# EAGLE design Nixie Clock v1.0 (EAGLE 9.6.2)

## Sheet 1 of 5: Microcontroller
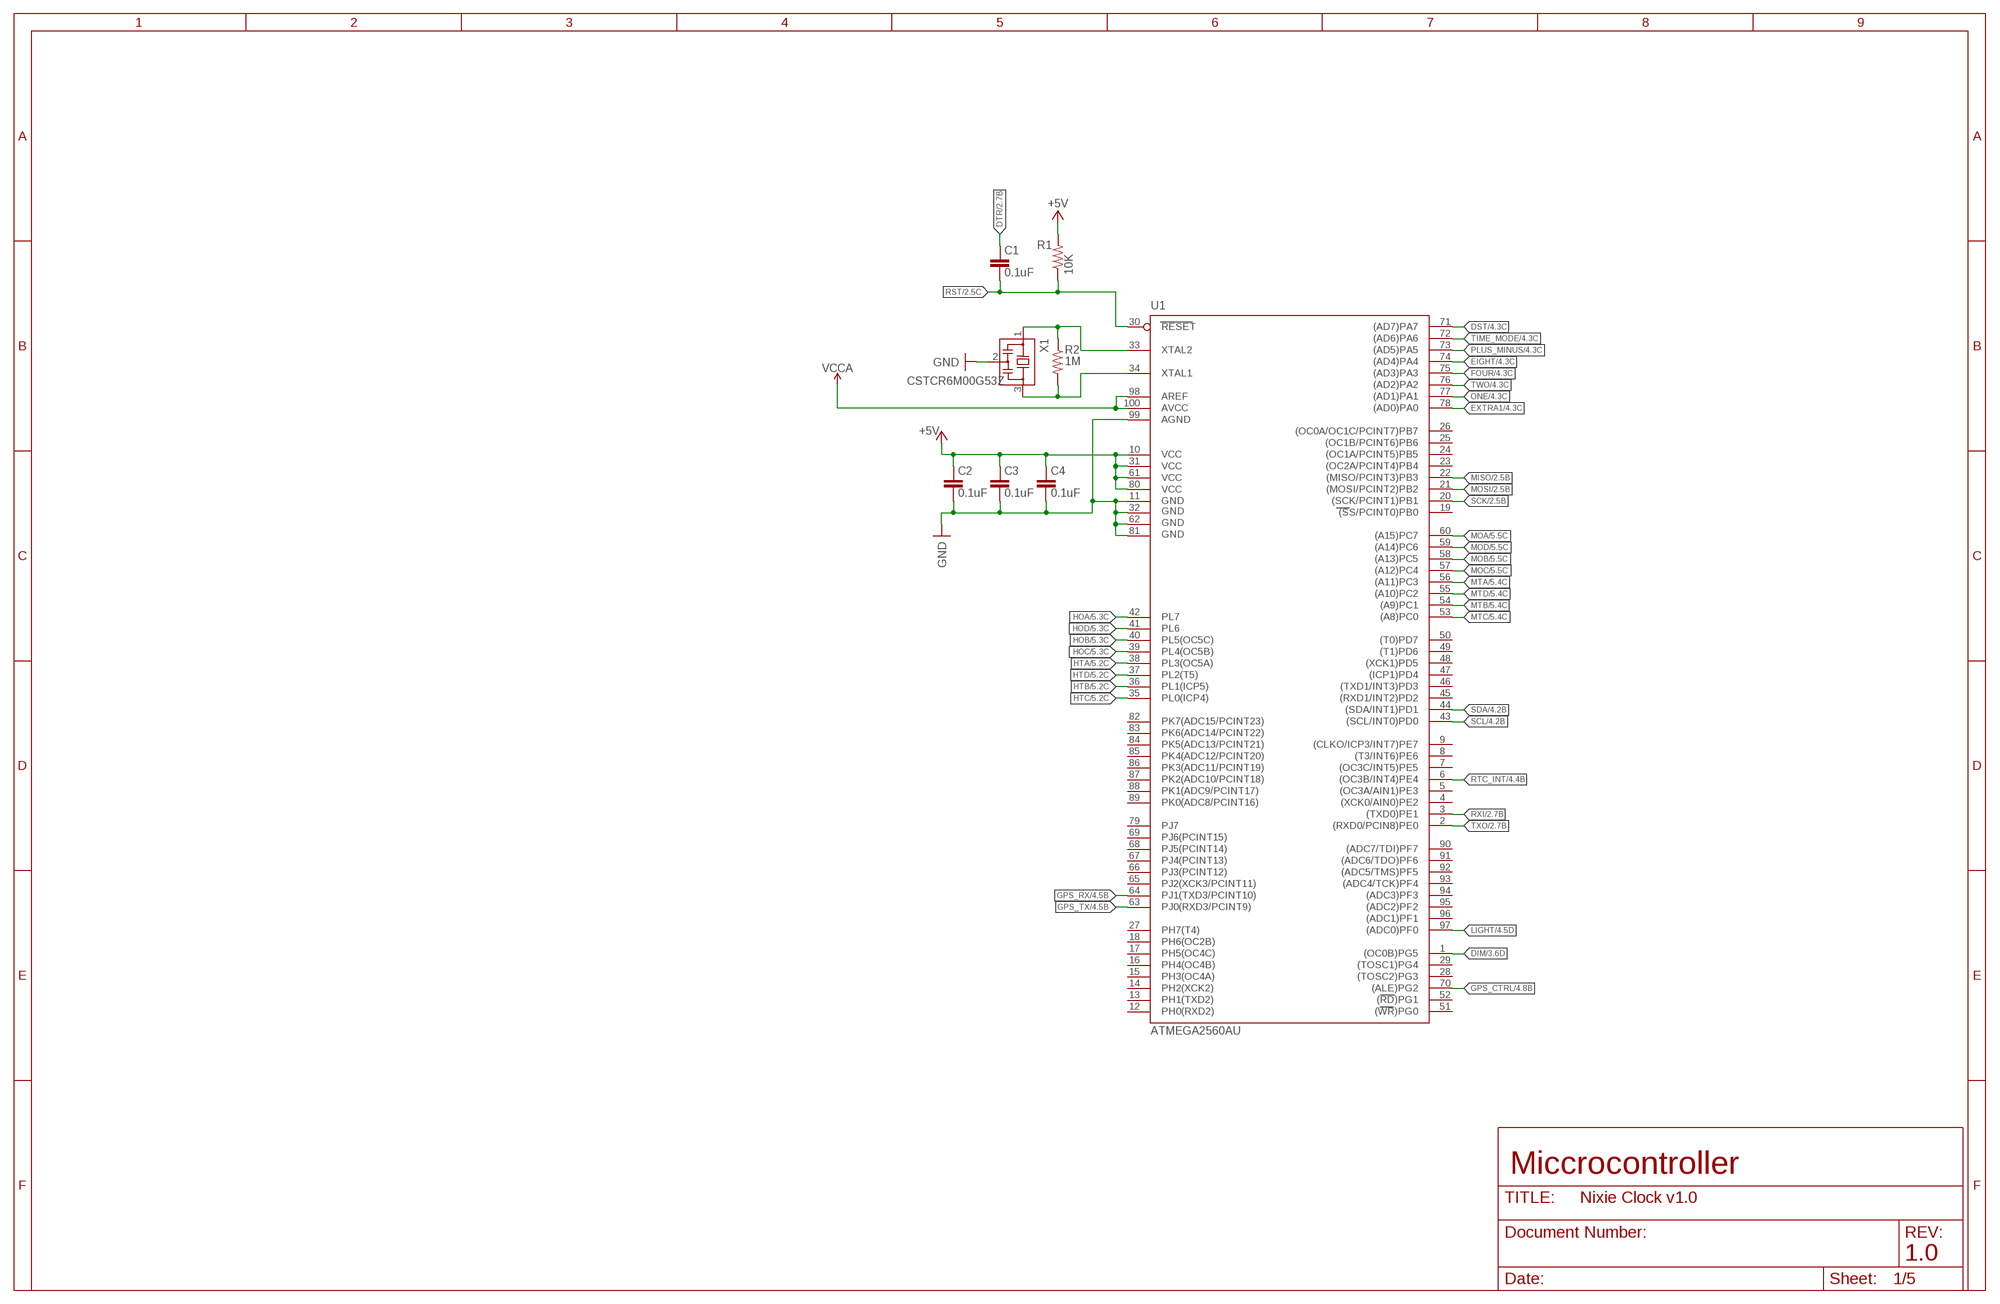
[diagram p0: schematic, sheet 1]

### Parts
C1  0.1uF  C-EUC0603  [C0603]
C2  0.1uF  C-EUC0603  [C0603]
C3  0.1uF  C-EUC0603  [C0603]
C4  0.1uF  C-EUC0603  [C0603]
R1  10K  R-US_R0603  [R0603]
R2  1M  R-US_R0603  [R0603]
U1  ATMEGA2560AU  [TQFP100]
X1  CSTCR6M00G53Z  [CSTCR6M]

### Nets
+5V: C2.1 C3.1 C4.1 R1.2 U1.10(VCC) U1.31(VCC1) U1.61(VCC2) U1.80(VCC3) ; also sheet 2,3,4,5
DIM: U1.1((OC0B)PG5) ; also sheet 3
DST: U1.71((AD7)PA7) ; also sheet 4
DTR: C1.1 ; also sheet 2
EIGHT: U1.74((AD4)PA4) ; also sheet 4
EXTRA1: U1.78((AD0)PA0) ; also sheet 4
FOUR: U1.75((AD3)PA3) ; also sheet 4
GND: C2.2 C3.2 C4.2 U1.11(GND) U1.32(GND1) U1.62(GND2) U1.81(GND3) U1.99(AGND) X1.2 ; also sheet 2,3,4,5
GPS_CTRL: U1.70((ALE)PG2) ; also sheet 4
GPS_RX: U1.64(PJ1(TXD3/PCINT10)) ; also sheet 4
GPS_TX: U1.63(PJ0(RXD3/PCINT9)) ; also sheet 4
HOA: U1.42(PL7) ; also sheet 5
HOB: U1.40(PL5(OC5C)) ; also sheet 5
HOC: U1.39(PL4(OC5B)) ; also sheet 5
HOD: U1.41(PL6) ; also sheet 5
HTA: U1.38(PL3(OC5A)) ; also sheet 5
HTB: U1.36(PL1(ICP5)) ; also sheet 5
HTC: U1.35(PL0(ICP4)) ; also sheet 5
HTD: U1.37(PL2(T5)) ; also sheet 5
LIGHT: U1.97((ADC0)PF0) ; also sheet 4
MISO: U1.22((MISO/PCINT3)PB3) ; also sheet 2
MOA: U1.60((A15)PC7) ; also sheet 5
MOB: U1.58((A13)PC5) ; also sheet 5
MOC: U1.57((A12)PC4) ; also sheet 5
MOD: U1.59((A14)PC6) ; also sheet 5
MOSI: U1.21((MOSI/PCINT2)PB2) ; also sheet 2
MTA: U1.56((A11)PC3) ; also sheet 5
MTB: U1.54((A9)PC1) ; also sheet 5
MTC: U1.53((A8)PC0) ; also sheet 5
MTD: U1.55((A10)PC2) ; also sheet 5
N$60: R2.2 U1.34(XTAL1) X1.3
N$61: R2.1 U1.33(XTAL2) X1.1
ONE: U1.77((AD1)PA1) ; also sheet 4
PLUS_MINUS: U1.73((AD5)PA5) ; also sheet 4
RST: C1.2 R1.1 U1.30(RESET) ; also sheet 2
RTC_INT: U1.6((OC3B/INT4)PE4) ; also sheet 4
RXI: U1.3((TXD0)PE1) ; also sheet 2
SCK: U1.20((SCK/PCINT1)PB1) ; also sheet 2
SCL: U1.43((SCL/INT0)PD0) ; also sheet 4
SDA: U1.44((SDA/INT1)PD1) ; also sheet 4
TIME_MODE: U1.72((AD6)PA6) ; also sheet 4
TWO: U1.76((AD2)PA2) ; also sheet 4
TXO: U1.2((RXD0/PCIN8)PE0) ; also sheet 2
VCCA: U1.98(AREF) U1.100(AVCC) ; also sheet 3,4
Unconnected: U1.4((XCK0/AIN0)PE2) U1.5((OC3A/AIN1)PE3) U1.7((OC3C/INT5)PE5) U1.8((T3/INT6)PE6) U1.9((CLKO/ICP3/INT7)PE7) U1.12(PH0(RXD2)) U1.13(PH1(TXD2)) U1.14(PH2(XCK2)) U1.15(PH3(OC4A)) U1.16(PH4(OC4B)) U1.17(PH5(OC4C)) U1.18(PH6(OC2B)) U1.19((SS/PCINT0)PB0) U1.23((OC2A/PCINT4)PB4) U1.24((OC1A/PCINT5)PB5) U1.25((OC1B/PCINT6)PB6) U1.26((OC0A/OC1C/PCINT7)PB7) U1.27(PH7(T4)) U1.28((TOSC2)PG3) U1.29((TOSC1)PG4) U1.45((RXD1/INT2)PD2) U1.46((TXD1/INT3)PD3) U1.47((ICP1)PD4) U1.48((XCK1)PD5) U1.49((T1)PD6) U1.50((T0)PD7) U1.51((WR)PG0) U1.52((RD)PG1) U1.65(PJ2(XCK3/PCINT11)) U1.66(PJ3(PCINT12)) U1.67(PJ4(PCINT13)) U1.68(PJ5(PCINT14)) U1.69(PJ6(PCINT15)) U1.79(PJ7) U1.82(PK7(ADC15/PCINT23)) U1.83(PK6(ADC14/PCINT22)) U1.84(PK5(ADC13/PCINT21)) U1.85(PK4(ADC12/PCINT20)) U1.86(PK3(ADC11/PCINT19)) U1.87(PK2(ADC10/PCINT18)) U1.88(PK1(ADC9/PCINT17)) U1.89(PK0(ADC8/PCINT16)) U1.90((ADC7/TDI)PF7) U1.91((ADC6/TDO)PF6) U1.92((ADC5/TMS)PF5) U1.93((ADC4/TCK)PF4) U1.94((ADC3)PF3) U1.95((ADC2)PF2) U1.96((ADC1)PF1)

### Notes on the sheet
- Miccrocontroller
- 1.0

## Sheet 2 of 5: Communication
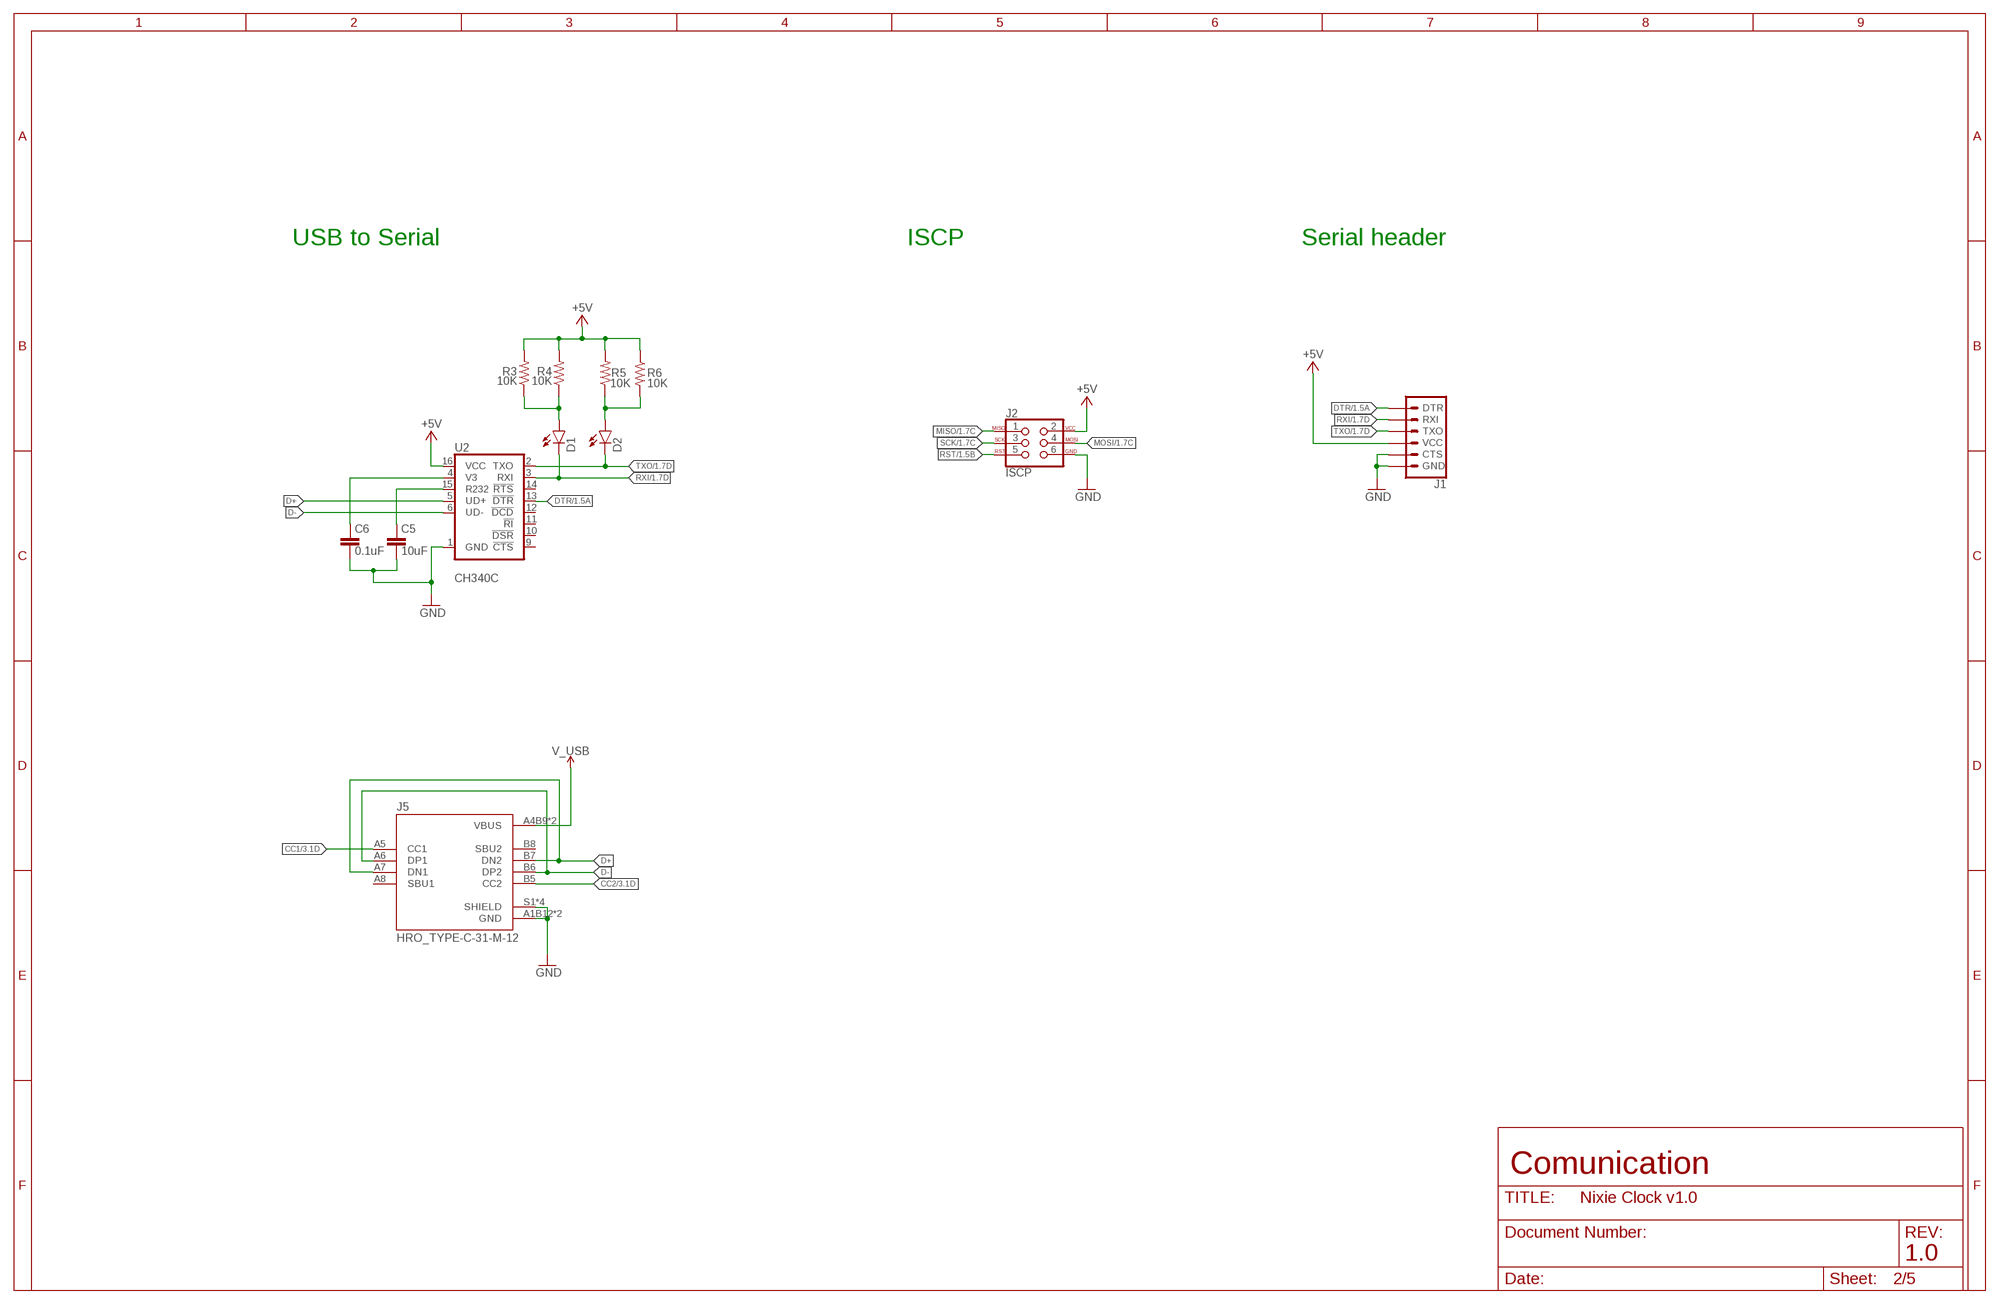
[diagram p1: schematic, sheet 2]

### Parts
C5  10uF  C-EUC0603  [C0603]
C6  0.1uF  C-EUC0603  [C0603]
D1  LEDCHIP-LED0603  [CHIP-LED0603]
D2  LEDCHIP-LED0603  [CHIP-LED0603]
J1  6_PIN_SERIAL_TARGETSILK  [6_PIN_SERIAL_TARGET_SIDE_W_SILK]
J2  ISCP  AVR_SPI_PROG_3X2PTH  [2X3]
J5  HRO_TYPE-C-31-M-12  [HRO_TYPE-C-31-M-12]
R3  10K  R-US_R0603  [R0603]
R4  10K  R-US_R0603  [R0603]
R5  10K  R-US_R0603  [R0603]
R6  10K  R-US_R0603  [R0603]
U2  CH340C  [SO016]

### Nets
+5V: J1.P$4(VCC) J2.2 R3.2 R4.2 R5.2 R6.1 U2.16(VCC) ; also sheet 1,3,4,5
CC1: J5.A5(CC1) ; also sheet 3
CC2: J5.B5(CC2) ; also sheet 3
D+: J5.A7(DN1) J5.B7(DN2) U2.5(UD+)
D-: J5.A6(DP1) J5.B6(DP2) U2.6(UD-)
DTR: J1.P$1(DTR) U2.13(!DTR) ; also sheet 1
GND: C5.2 C6.2 J1.P$5(CTS) J1.P$6(GND) J2.6 J5.A1B12(GND) J5.B1A12(GND) J5.S1(SHIELD) J5.S2(SHIELD) J5.S3(SHIELD) J5.S4(SHIELD) U2.1(GND) ; also sheet 1,3,4,5
MISO: J2.1 ; also sheet 1
MOSI: J2.4 ; also sheet 1
N$1: C5.1 U2.15(R232)
N$2: C6.1 U2.4(V3)
N$49: D1.A R3.1 R4.1
N$50: D2.A R5.1 R6.2
RST: J2.5 ; also sheet 1
RXI: D1.C J1.P$3(RXI) U2.3(RXI) ; also sheet 1
SCK: J2.3 ; also sheet 1
TXO: D2.C J1.P$2(TXO) U2.2(TXO) ; also sheet 1
V_USB: J5.A4B9(VBUS) J5.B4A9(VBUS) ; also sheet 3
Unconnected: J5.A8(SBU1) J5.B8(SBU2) U2.9(!CTS) U2.10(!DSR) U2.11(!RI) U2.12(!DCD) U2.14(!RTS)

### Notes on the sheet
- USB to Serial | ISCP | Serial header
- Comunication
- 1.0

## Sheet 3 of 5: Power
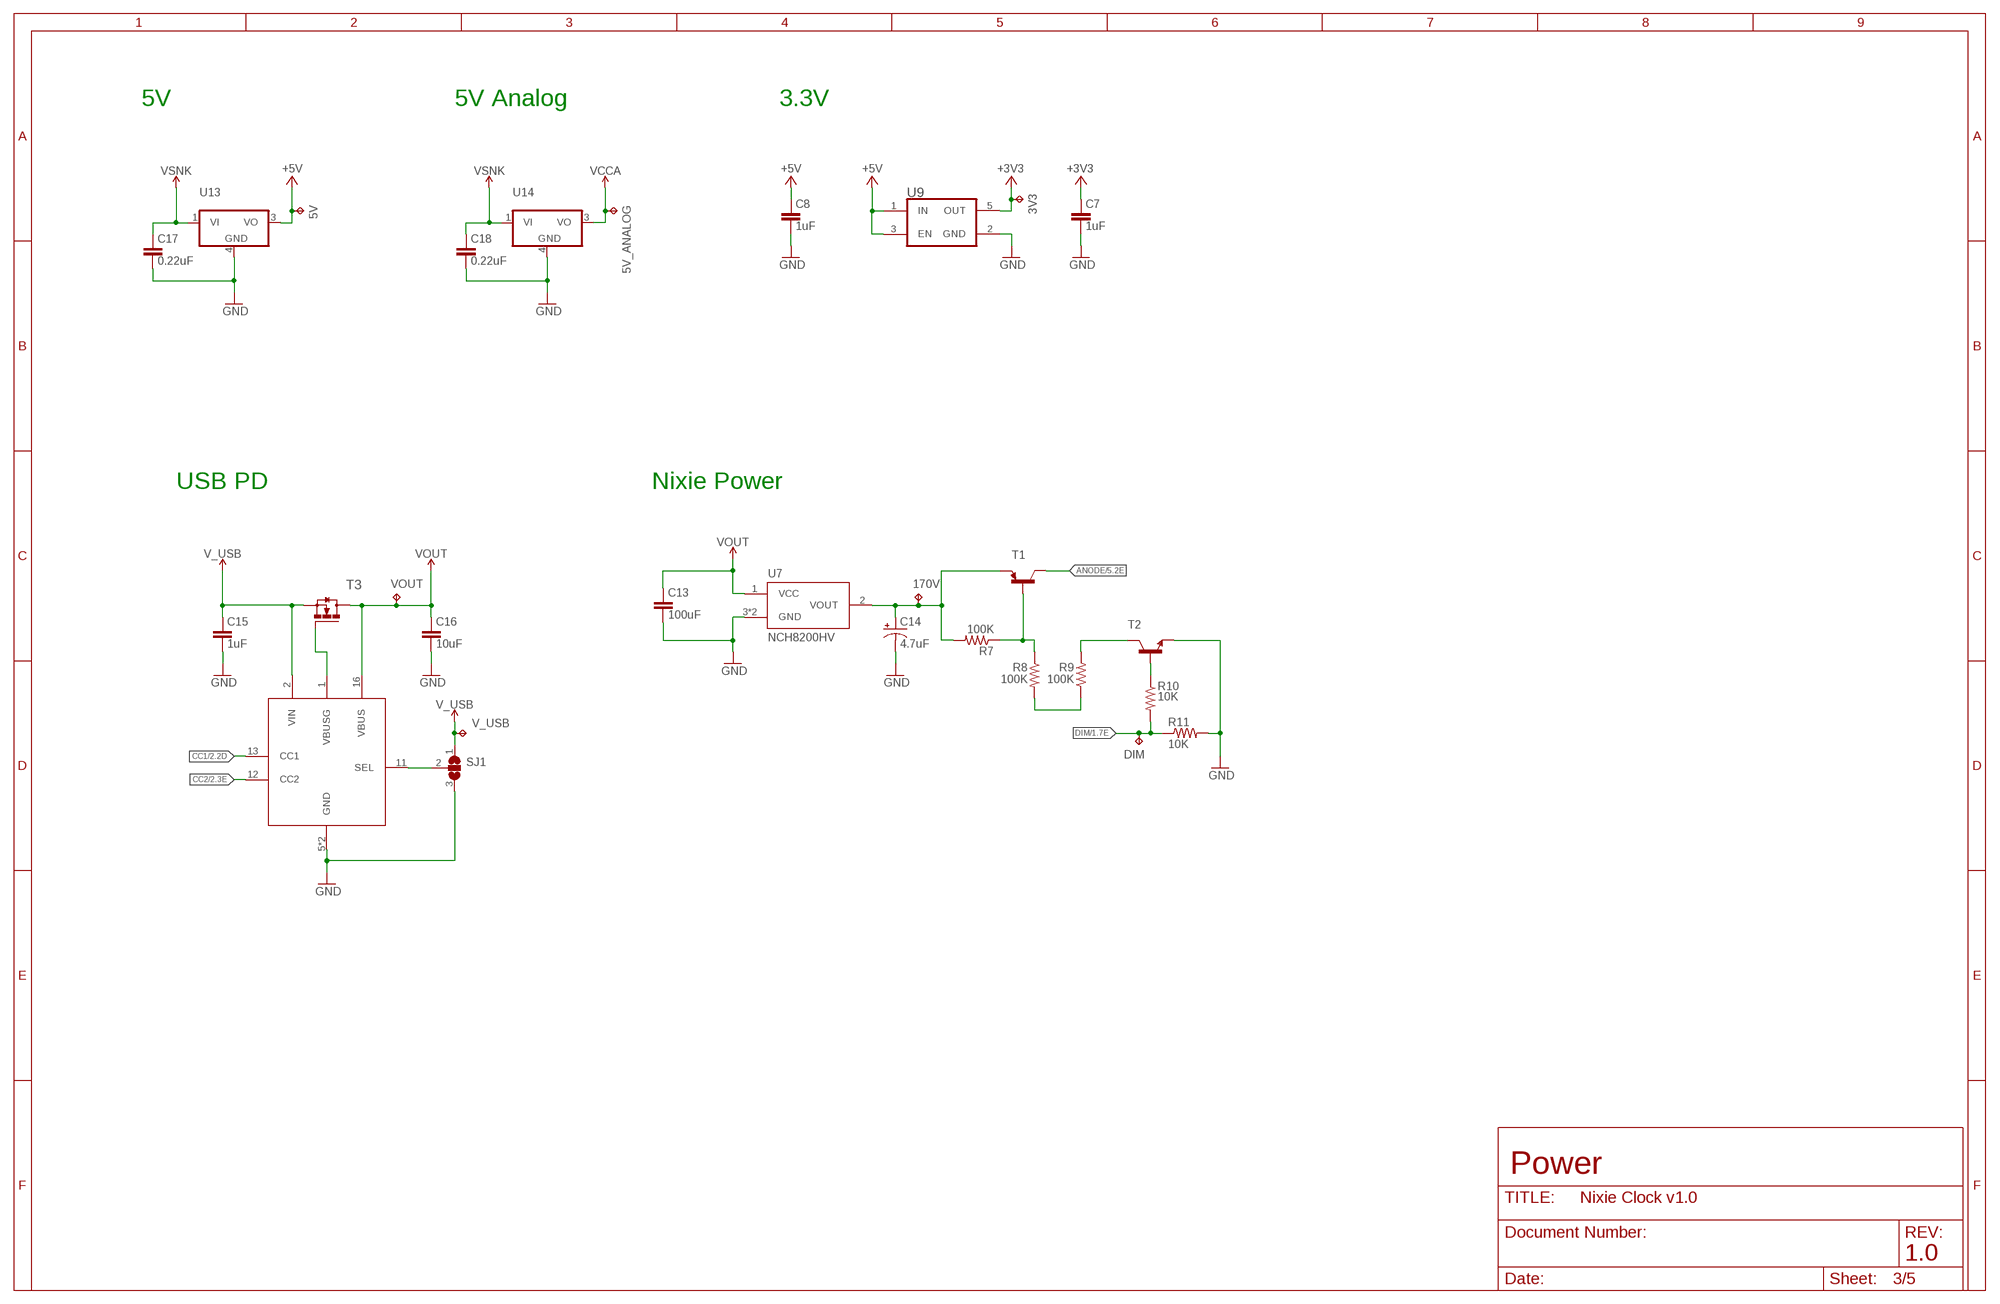
[diagram p2: schematic, sheet 3]

### Parts
3V3  TPPAD1-13  [P1-13]
5V  TPPAD1-13  [P1-13]
5V_ANALOG  TPPAD1-13  [P1-13]
170V  TPPAD1-13  [P1-13]
C7  1uF  C-EUC0603  [C0603]
C8  1uF  C-EUC0603  [C0603]
C13  100uF  C-EUC0603  [C0603]
C14  4.7uF  CPOL-USE3.5-8  [E3,5-8]
C15  1uF  C-EUC0603  [C0603]
C16  10uF  C-EUC0603  [C0603]
C17  0.22uF  C-EUC0603  [C0603]
C18  0.22uF  C-EUC0603  [C0603]
DIM  TPPAD1-13  [P1-13]
R7  100K  R-US_R0603  [R0603]
R8  100K  R-US_R0603  [R0603]
R9  100K  R-US_R0603  [R0603]
R10  10K  R-US_R0603  [R0603]
R11  10K  R-US_R0603  [R0603]
SJ1  SJ2W  [SJ_2]
T1  PZTA92  [SOT223]
T2  PZTA42  [SOT223]
T3  CSD18543Q3A  [VSONP-8]
U7  NCH8200HV  [NCH8200HV]
U9  MIC5504-3.3YM5TR  [SOT95P280X130-5N]
U12  IP2721  [TSSOP16EXP]
U13  LM340MP-05  [SOT223]
U14  LM340MP-05  [SOT223]
V_USB  TPPAD1-13  [P1-13]
VOUT  TPPAD1-13  [P1-13]

### Nets
+3V3: 3V3.TP C7.1 U9.5(OUT) ; also sheet 4
+5V: 5V.TP C8.1 U9.1(IN) U9.3(EN) U13.3(VO) ; also sheet 1,2,4,5
ANODE: T1.2(C) T1.4(C) ; also sheet 5
CC1: U12.13(CC1) ; also sheet 2
CC2: U12.12(CC2) ; also sheet 2
DIM: DIM.TP R10.2 R11.1 ; also sheet 1
GND: C7.2 C8.2 C13.2 C14.- C15.2 C16.2 C17.2 C18.2 R11.2 SJ1.3 T2.3(E) U7.3(GND) U7.4(GND) U9.2(GND) U12.5(GND) U12.EXP(GND) U13.4(GND) U14.4(GND) ; also sheet 1,2,4,5
N$3: T3.4(G) U12.1(VBUSG)
N$4: SJ1.2 U12.11(SEL)
N$6: R10.1 T2.1(B)
N$51: 170V.TP C14.+ R7.2 T1.3(E) U7.2(VOUT)
N$53: R7.1 R8.1 T1.1(B)
N$63: R9.2 T2.2(C) T2.4(C)
N$64: R8.2 R9.1
V_USB: C15.1 SJ1.1 T3.1(S) T3.2(S) T3.3(S) U12.2(VIN) V_USB.TP ; also sheet 2
VCCA: 5V_ANALOG.TP U14.3(VO) ; also sheet 1,4
VOUT: C13.1 C16.1 C17.1 C18.1 T3.5(D) T3.6(D) T3.7(D) T3.8(D) T3.9(D) T3.10(D) T3.11(D) T3.12(D) U7.1(VCC) U12.16(VBUS) U13.1(VI) U14.1(VI) VOUT.TP ; supply symbol labelled VSNK

### Notes on the sheet
- 5V | 5V Analog | 3.3V
- USB PD | Nixie Power
- Power
- 1.0

## Sheet 4 of 5: RTC and GPS
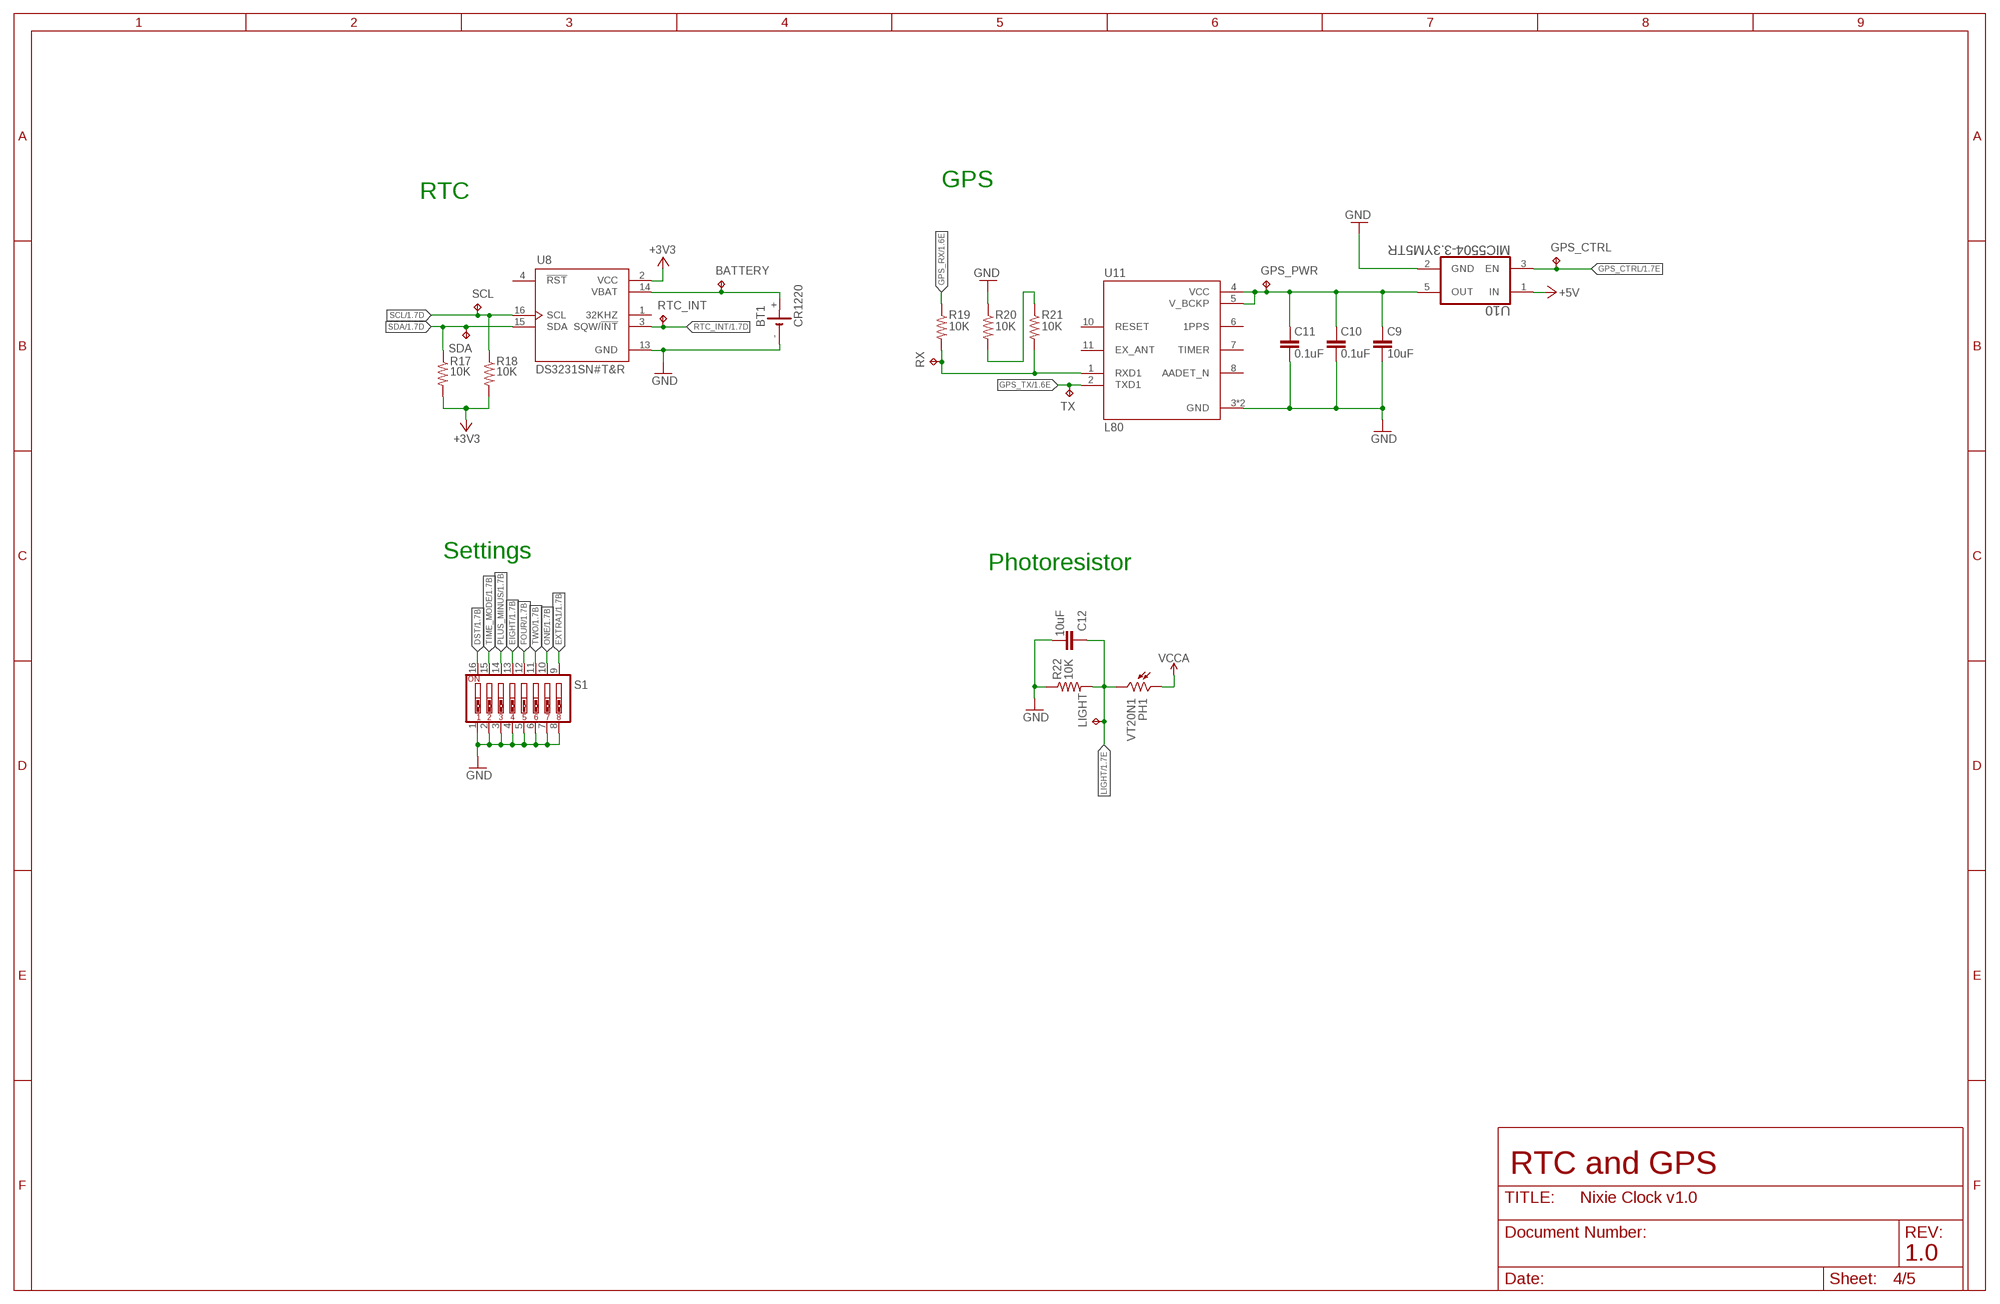
[diagram p3: schematic, sheet 4]

### Parts
BATTERY  TPPAD1-13  [P1-13]
BT1  CR1220  CH291-1220LF  [CH291-1220LF]
C9  10uF  C-EUC0603  [C0603]
C10  0.1uF  C-EUC0603  [C0603]
C11  0.1uF  C-EUC0603  [C0603]
C12  10uF  C-EUC0603  [C0603]
GPS_CTRL  TPPAD1-13  [P1-13]
GPS_PWR  TPPAD1-13  [P1-13]
LIGHT  TPPAD1-13  [P1-13]
PH1  VT20N1  [TO46-VT200]
R17  10K  R-US_R0603  [R0603]
R18  10K  R-US_R0603  [R0603]
R19  10K  R-US_R0603  [R0603]
R20  10K  R-US_R0603  [R0603]
R21  10K  R-US_R0603  [R0603]
R22  10K  R-US_R0603  [R0603]
RTC_INT  TPPAD1-13  [P1-13]
RX  TPPAD1-13  [P1-13]
S1  SW_DIP-8  [EDG-08]
SCL  TPPAD1-13  [P1-13]
SDA  TPPAD1-13  [P1-13]
TX  TPPAD1-13  [P1-13]
U8  DS3231SN#T&R  [SOIC127P1032X265-16N]
U10  MIC5504-3.3YM5TR  [SOT95P280X130-5N]
U11  L80  [XCVR_L80]

### Nets
+3V3: R17.2 R18.2 U8.2(VCC) ; also sheet 3
+5V: U10.1(IN) ; also sheet 1,2,3,5
DST: S1.16 ; also sheet 1
EIGHT: S1.13 ; also sheet 1
EXTRA1: S1.9 ; also sheet 1
FOUR: S1.12 ; also sheet 1
GND: BT1.- C9.2 C10.2 C11.2 C12.2 R20.1 R22.1 S1.1 S1.2 S1.3 S1.4 S1.5 S1.6 S1.7 S1.8 U8.13(GND) U10.2(GND) U11.3(GND) U11.12(GND) ; also sheet 1,2,3,5
GPS_CTRL: GPS_CTRL.TP U10.3(EN) ; also sheet 1
GPS_RX: R19.1 ; also sheet 1
GPS_TX: TX.TP U11.2(TXD1) ; also sheet 1
LIGHT: C12.1 LIGHT.TP PH1.2 R22.2 ; also sheet 1
N$55: BATTERY.TP BT1.+ U8.14(VBAT)
N$56: C9.1 C10.1 C11.1 GPS_PWR.TP U10.5(OUT) U11.4(VCC) U11.5(V_BCKP)
N$57: R19.2 R21.2 RX.TP U11.1(RXD1)
N$58: R20.2 R21.1
ONE: S1.10 ; also sheet 1
PLUS_MINUS: S1.14 ; also sheet 1
RTC_INT: RTC_INT.TP U8.3(SQW/!INT) ; also sheet 1
SCL: R18.1 SCL.TP U8.16(SCL) ; also sheet 1
SDA: R17.1 SDA.TP U8.15(SDA) ; also sheet 1
TIME_MODE: S1.15 ; also sheet 1
TWO: S1.11 ; also sheet 1
VCCA: PH1.1 ; also sheet 1,3
Unconnected: U8.1(32KHZ) U8.4(!RST) U11.6(1PPS) U11.7(TIMER) U11.8(AADET_N) U11.10(RESET) U11.11(EX_ANT)

### Notes on the sheet
- GPS
- RTC
- Settings
- Photoresistor
- RTC and GPS
- 1.0

## Sheet 5 of 5: Nixie Tubes and Drivers
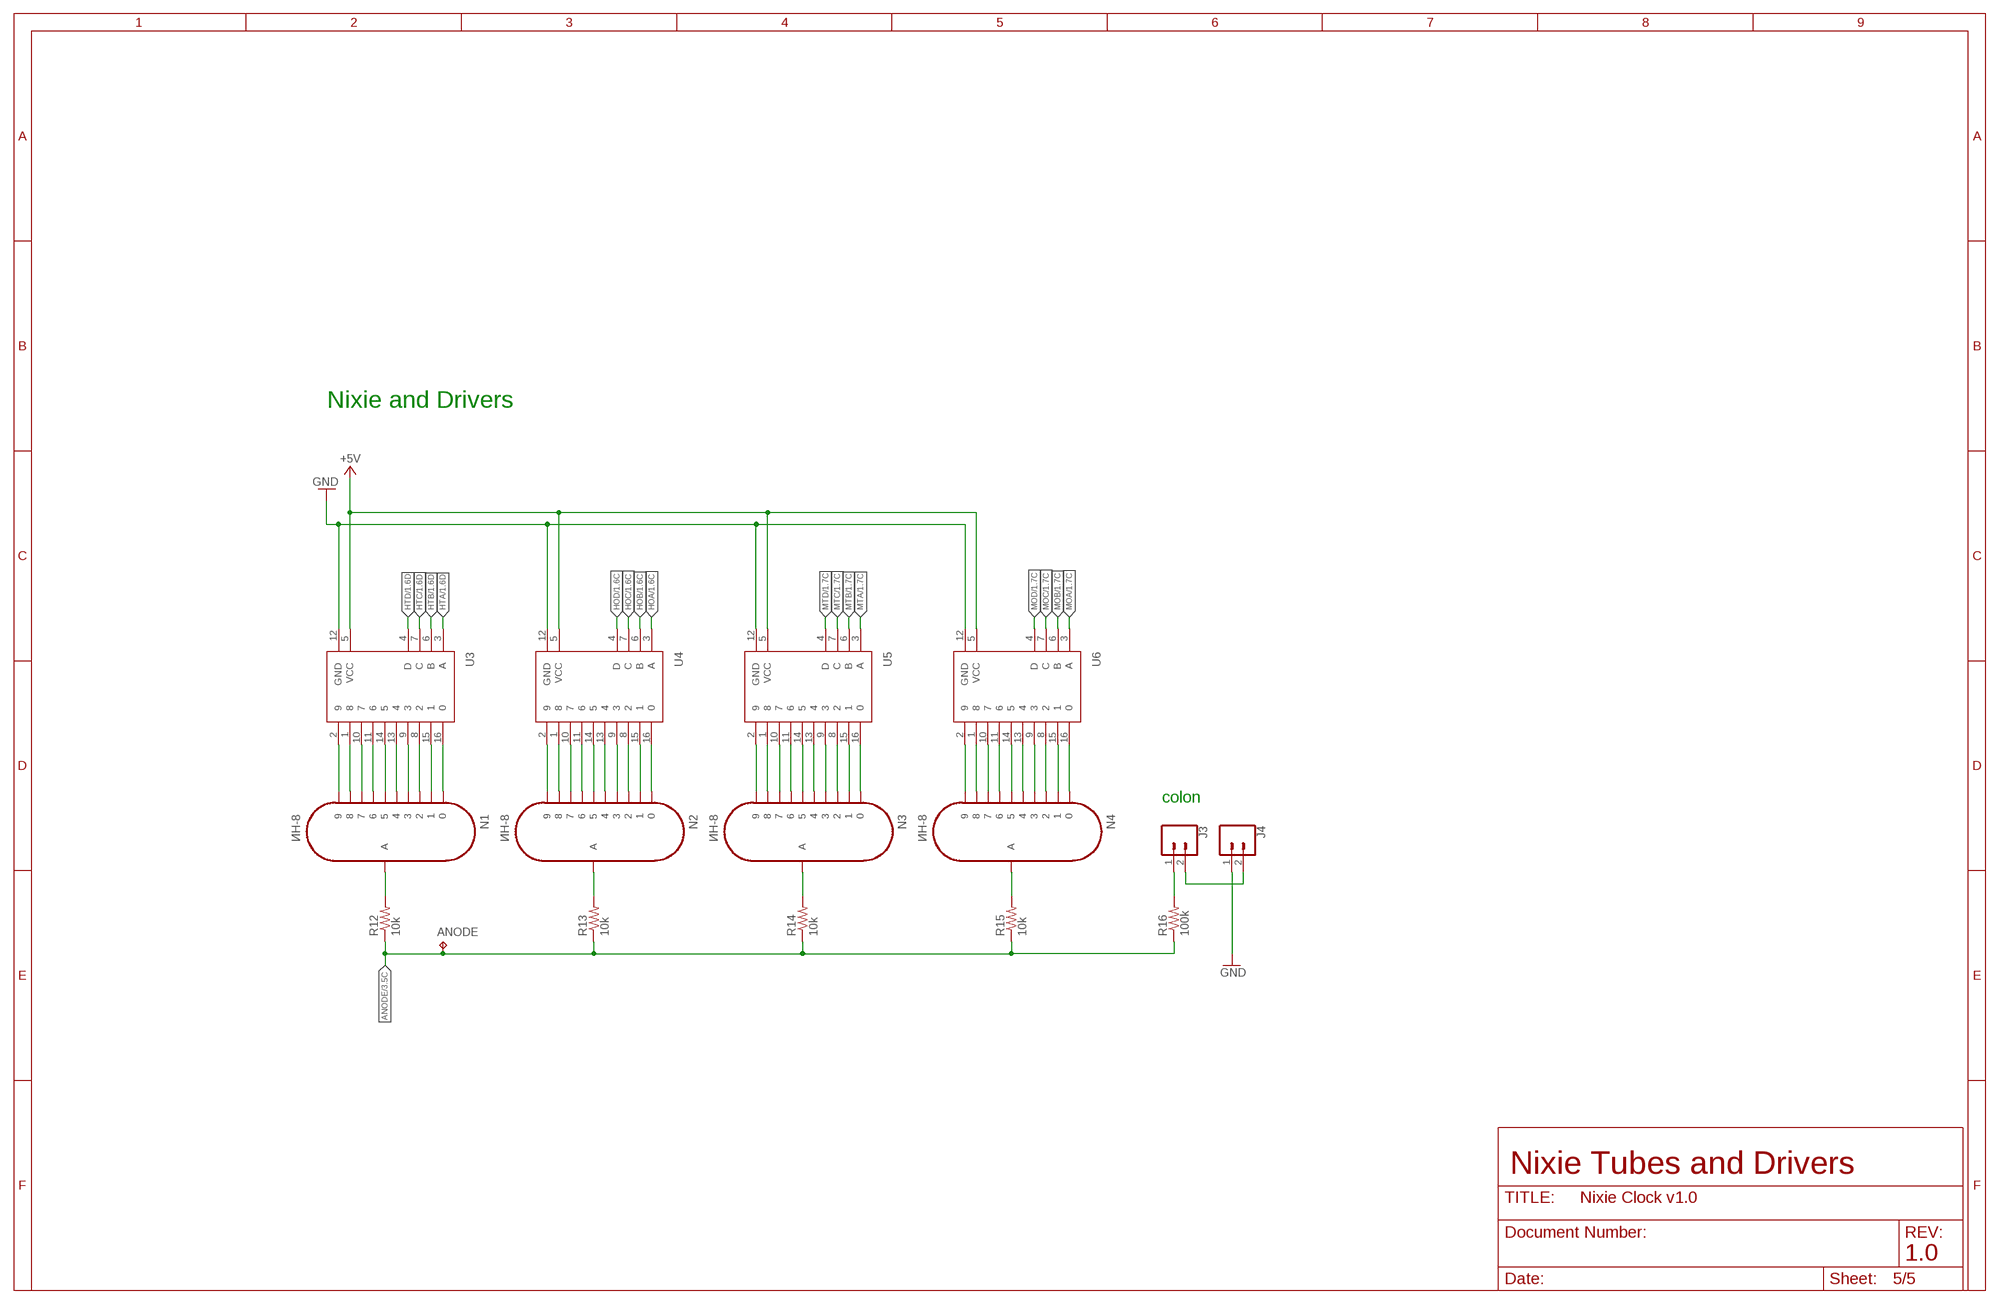
[diagram p4: schematic, sheet 5]

### Parts
ANODE  TPPAD1-13  [P1-13]
J3  CONN_02LOCK_LONGPADS  [1X02_LOCK_LONGPADS]
J4  CONN_02LOCK_LONGPADS  [1X02_LOCK_LONGPADS]
N1  ИН-8  IN-8IN-8_SOCKET  [IN-8_SOCKET]
N2  ИН-8  IN-8IN-8_SOCKET  [IN-8_SOCKET]
N3  ИН-8  IN-8IN-8_SOCKET  [IN-8_SOCKET]
N4  ИН-8  IN-8IN-8_SOCKET  [IN-8_SOCKET]
R12  10k  R-US_M0805  [M0805]
R13  10k  R-US_M0805  [M0805]
R14  10k  R-US_M0805  [M0805]
R15  10k  R-US_M0805  [M0805]
R16  100k  R-US_R0603  [R0603]
U3  K155ID1  [DIL16-KIT]
U4  K155ID1  [DIL16-KIT]
U5  K155ID1  [DIL16-KIT]
U6  K155ID1  [DIL16-KIT]

### Nets
+5V: U3.5(VCC) U4.5(VCC) U5.5(VCC) U6.5(VCC) ; also sheet 1,2,3,4
ANODE: ANODE.TP R12.1 R13.1 R14.1 R15.1 R16.1 ; also sheet 3
GND: J4.1 U3.12(GND) U4.12(GND) U5.12(GND) U6.12(GND) ; also sheet 1,2,3,4
HOA: U4.3(A) ; also sheet 1
HOB: U4.6(B) ; also sheet 1
HOC: U4.7(C) ; also sheet 1
HOD: U4.4(D) ; also sheet 1
HTA: U3.3(A) ; also sheet 1
HTB: U3.6(B) ; also sheet 1
HTC: U3.7(C) ; also sheet 1
HTD: U3.4(D) ; also sheet 1
MOA: U6.3(A) ; also sheet 1
MOB: U6.6(B) ; also sheet 1
MOC: U6.7(C) ; also sheet 1
MOD: U6.4(D) ; also sheet 1
MTA: U5.3(A) ; also sheet 1
MTB: U5.6(B) ; also sheet 1
MTC: U5.7(C) ; also sheet 1
MTD: U5.4(D) ; also sheet 1
N$5: J3.1 R16.2
N$7: J3.2 J4.2
N$16: N1.9 U3.2
N$17: N1.8 U3.1
N$18: N1.7 U3.10
N$19: N1.6 U3.11
N$20: N1.5 U3.14
N$21: N1.4 U3.13
N$22: N1.3 U3.9
N$23: N1.2 U3.8
N$24: N1.1 U3.15
N$25: N1.0 U3.16
N$26: N1.A R12.2
N$27: N2.9 U4.2
N$28: N2.8 U4.1
N$29: N2.7 U4.10
N$30: N2.6 U4.11
N$31: N2.5 U4.14
N$32: N2.4 U4.13
N$33: N2.3 U4.9
N$34: N2.2 U4.8
N$35: N2.1 U4.15
N$36: N2.0 U4.16
N$37: N2.A R13.2
N$62: N3.9 U5.2
N$65: N3.8 U5.1
N$66: N3.7 U5.10
N$67: N3.6 U5.11
N$68: N3.5 U5.14
N$69: N3.4 U5.13
N$70: N3.3 U5.9
N$71: N3.2 U5.8
N$72: N3.1 U5.15
N$73: N3.0 U5.16
N$74: N3.A R14.2
N$86: N4.9 U6.2
N$87: N4.8 U6.1
N$88: N4.7 U6.10
N$89: N4.6 U6.11
N$90: N4.5 U6.14
N$91: N4.4 U6.13
N$92: N4.3 U6.9
N$93: N4.2 U6.8
N$94: N4.1 U6.15
N$95: N4.0 U6.16
N$96: N4.A R15.2

### Notes on the sheet
- Nixie and Drivers
- colon
- Nixie Tubes and Drivers
- 1.0

## Library data of the parts
3V3 5V 5V_ANALOG 170V ANODE BATTERY DIM GPS_CTRL GPS_PWR LIGHT RTC_INT RX SCL SDA TX V_USB VOUT = testpad:TP: Test pad
BT1 = battery:CH291-1220LF: Battery Holder, SMT, 12mm multicomp PART NO. CH291-1220LF Source: Data sheet <http://www.farnell.com/datasheets/1505860.pdf>
C1-C13 C15-C18 = rcl:C-EU: CAPACITOR, European symbol; SPICEPREFIX: C
C14 = rcl:CPOL-US: POLARIZED CAPACITOR, American symbol; SPICEPREFIX: C
D1 D2 = led:LED: LED OSRAM: - CHIPLED LG R971, LG N971, LY N971, LG Q971, LY Q971, LO R971, LY R971 LH N974, LH R974 LS Q976, LO Q976, LY Q976 LO Q996 - Hyper CHIPLED LW Q18S LB Q993, LB Q99A, LB R99A - SideLED LS A670, LO A670, LY A670, LG A670, LP A670 LB A673, LV A673, LT A673, LW A673 LH A674 LY A675 LS A676, LA A676, LO A676, LY A676, LW A676 LS A679, LY A679, LG A679 - Hyper Micro SIDELED® LS Y876, LA Y876, LO Y876, LY Y876 LT Y87S - SmartLED LW L88C, LW L88S LB L89C, LB L89S, LG L890 LS L89K, LO L89K, LY L89K LS L896, LA L896, LO L896, LY L896 - TOPLED LS T670, LO T670, LY T670, LG T670, LP T670 LSG T670, LSP T670, LSY T670, LOP T670, LYG T670 LG T671, LOG T671, LSG T671 LB T673, LV T673, LT T673, LW T673 LH T674 LS T676, LA T676, LO T676, LY T676, LB T676, LH T676, LSB T676, LW T676 LB T67C, LV T67C, LT T67C, LS T67K, LO T67K, LY T67K, LW E67C LS E67B, LA E67B, LO E67B, LY E67B, LB E67C, LV E67C, LT E67C LW T67C LS T679, LY T679, LG T679 LS T770, LO T770, LY T770, LG T770, LP T770 LB T773, LV T773, LT T773, LW T773 LH T774 LS E675, LA E675, LY E675, LS T675 LS T776, LA T776, LO T776, LY T776, LB T776 LHGB T686 LT T68C, LB T68C - Hyper Mini TOPLED® LB M676 - Mini TOPLED Santana® LG M470 LS M47K, LO M47K, LY M47K Source: http://www.osram.convergy.de LUXEON: - LUMILED® LXK2-PW12-R00, LXK2-PW12-S00, LXK2-PW14-U00, LXK2-PW14-V00 LXK2-PM12-R00, LXK2-PM12-S00, LXK2-PM14-U00 LXK2-PE12-Q00, LXK2-PE12-R00, LXK2-PE12-S00, LXK2-PE14-T00, LXK2-PE14-U00 LXK2-PB12-K00, LXK2-PB12-L00, LXK2-PB12-M00, LXK2-PB14-N00, LXK2-PB14-P00, LXK2-PB14-Q00 LXK2-PR12-L00, LXK2-PR12-M00, LXK2-PR14-Q00, LXK2-PR14-R00 LXK2-PD12-Q00, LXK2-PD12-R00, LXK2-PD12-S00 LXK2-PH12-R00, LXK2-PH12-S00 LXK2-PL12-P00, LXK2-PL12-Q00, LXK2-PL12-R00 Source: www.luxeon.com KINGBRIGHT: KA-3528ASYC Source: www.kingbright.com
J1 = SparkFun-Connectors:6_PIN_SERIAL_TARGET: 6-pin header connection for use with the "FTDI BASIC" pinout - TARGET SIDE. Also known as "Arduino Serial Program Header". It is used to mate with our FTDI Basic serial programmers using the Arduino IDE. Note, this device has "TARGET" in the name. It is intended to be used on a design that contains a target micro-controller that you wish to program. The "sister" device, named "CABLE" is inteneded to be used on a design that usually lives on the end of your USB cable and prvides the converter chip (FTDI232 or FTDI231x) to commnicate serial RX/TX. You can populate with some of these: Break Away Headers - Straight <https://www.sparkfun.com/products/116> (PRT-00116) For reference (or to suit your programming needs) check out these designs: SparkFun FTDI Basic Breakout - 5V <https://www.sparkfun.com/products/9716> (DEV-09716) SparkFun FTDI Basic Breakout - 3.3V <https://www.sparkfun.com/products/9873> (DEV-09873) SparkFun FTDI SmartBasic <https://www.sparkfun.com/products/12935> (DEV-12935) SparkFun Beefy 3 - FTDI Basic Breakout <https://www.sparkfun.com/products/13746> (DEV-13746)
J2 = SparkFun-Connectors:AVR_SPI_PROG_3X2: AVR ISP 6 Pin This is the reduced ISP connector for AVR programming. Common on Arduino. This footprint will take up less PCB space and can be used with a 10-pin to 6-pin adapter such as SKU: BOB-08508 **Special note about "TEST_POINT" package. The stop mask is on the top side, so if you want your programming test points to be on the bottom of your board, make sure to place this package on the bottom side of the board. This also ensure that the orientation to program from the bottom side will be correct. SparkFun Products: SparkFun ISP Pogo Adapter <https://www.sparkfun.com/products/11591> - NS Tiny AVR Programmer <https://www.sparkfun.com/products/11801> -PTH
J3 J4 = SparkFun-Connectors:CONN_02: Multi connection point. Often used as Generic Header-pin footprint for 0.1 inch spaced/style header connections On any of the 0.1 inch spaced packages, you can populate with these: Break Away Headers - Straight <https://www.sparkfun.com/products/116> (PRT-00116) Break Away Male Headers - Right Angle <https://www.sparkfun.com/products/553> (PRT-00553) Female Headers <https://www.sparkfun.com/products/115> (PRT-00115) Break Away Headers - Machine Pin <https://www.sparkfun.com/products/117> (PRT-00117) Break Away Female Headers - Swiss Machine Pin <https://www.sparkfun.com/products/743> (PRT-00743) For SCREWTERMINALS and SPRING TERMINALS visit here: Screw Terimnals on SparkFun.com <https://www.sparkfun.com/search/results?term=Screw+Terminals> (5mm/3.5mm/2.54mm spacing) This device is also useful as a general connection point to wire up your design to another part of your project. Our various solder wires solder well into these plated through hole pads. Hook-Up Wire - Assortment (Stranded, 22 AWG) <https://www.sparkfun.com/products/11375> (PRT-11375) Hook-Up Wire - Assortment (Solid Core, 22 AWG) <https://www.sparkfun.com/products/11367> (PRT-11367) View the entire wire category on our website here <https://www.sparkfun.com/categories/141> Special notes: Molex polarized connector foot print use with: PRT-08233 with associated crimp pins and housings. 2.54_SCREWTERM for use with PRT-10571. 3.5mm Screw Terminal footprints for PRT-08084 5mm Screw Terminal footprints for use with PRT-08432
J5 = My Components:HRO_TYPE-C-31-M-12: USB Connectors 24 Receptacle 1 8.94*7.3mm RoHS; AVAILABILITY: Unavailable; DESCRIPTION: USB Connectors 24 Receptacle 1 8.94*7.3mm RoHS; MF: HRO Electronics Co., Ltd.; MP: TYPE-C-31-M-12; PACKAGE: Package; PRICE: None
N1-N4 = russian-nixies:IN-8
PH1 = photo-elements:VT2*: Photoconductive Cell VT200 Series Source: http://optoelectronics.perkinelmer.com/content/Datasheets/DTS_vt200seriesdatasheet.pdf
R1-R22 = rcl:R-US_: RESISTOR, American symbol; SPICEPREFIX: R
S1 = special:SW_DIP-8: DIP SWITCH
SJ1 = jumper:SJ2W: SMD solder JUMPER
T1 = My Components:PZTA92
T2 = My Components:PZTA42
T3 = My Components:CSD18543Q3A; MFR: TI; MPN: CSD18543Q3A
U1 = SparkFun-IC-Microcontroller:ATMEGA2560: Atmel 100-pin 8-bit uC 64/128/256 Kbytes FLASH 4 Kbytes EEPROM 8 Kbytes SRAM 86 General Purpose I/O pins 12-channels16-bit PWM 4 x Serial USARTs 16-channels 10-bit A/D SparkFun Products None.; MPN: ATMEGA2560-16AU; PROD_ID: IC-10040
U2 = SparkFun-IC-Comms:CH340C; MPN: CH340C; PROD_ID: IC-14038
U3-U6 = russian-nixies:K155ID1
U7 = My Components:NCH8200HV
U8 = My Components:DS3231SN#T&R: Real Time Clock Serial 16-Pin SOIC W T/R; AVAILABILITY: Unavailable; DESCRIPTION: Real Time Clock _RTC_ IC Clock/Calendar I²C, 2-Wire Serial 16-SOIC _0.295, 7.50mm Width_; MF: Maxim Integrated; MP: DS3231SN#T&amp;R; PACKAGE: SOIC-16 Maxim; PRICE: None
U9 U10 = My Components:MIC5504-3.3YM5TR; MPN: MIC5504-3.3YM5-TR
U11 = My Components:L80; AVAILABILITY: Unavailable; DESCRIPTION: L80 is an ultra compact GPS POT _Patch on Top_ module with an embedded 15.0mm × 15.0mm × 4.0mm patch antenna.; MF: Quectel; MP: L80-M39; PACKAGE: Radial Can Quectel; PRICE: None
U12 = My Components:IP2721
U13 = linear:LM340?-*: Positive VOLTAGE REGULATOR Source: http://cache.national.com/ds/LM/LM340.pdf; MFR: TI; MPN: LM340MP-5.0/NOPB
U14 = linear:LM340?-*: Positive VOLTAGE REGULATOR Source: http://cache.national.com/ds/LM/LM340.pdf; MFN: TI; MON: LM340MP-5.0/NOPB
X1 = murata-filter:CSTCR: Resonator Source: murata.co.jp; MPN: CSTCE16M0V13C99-R0; OC_FARNELL: 1170434; OC_NEWARK: 25M8759

## Board
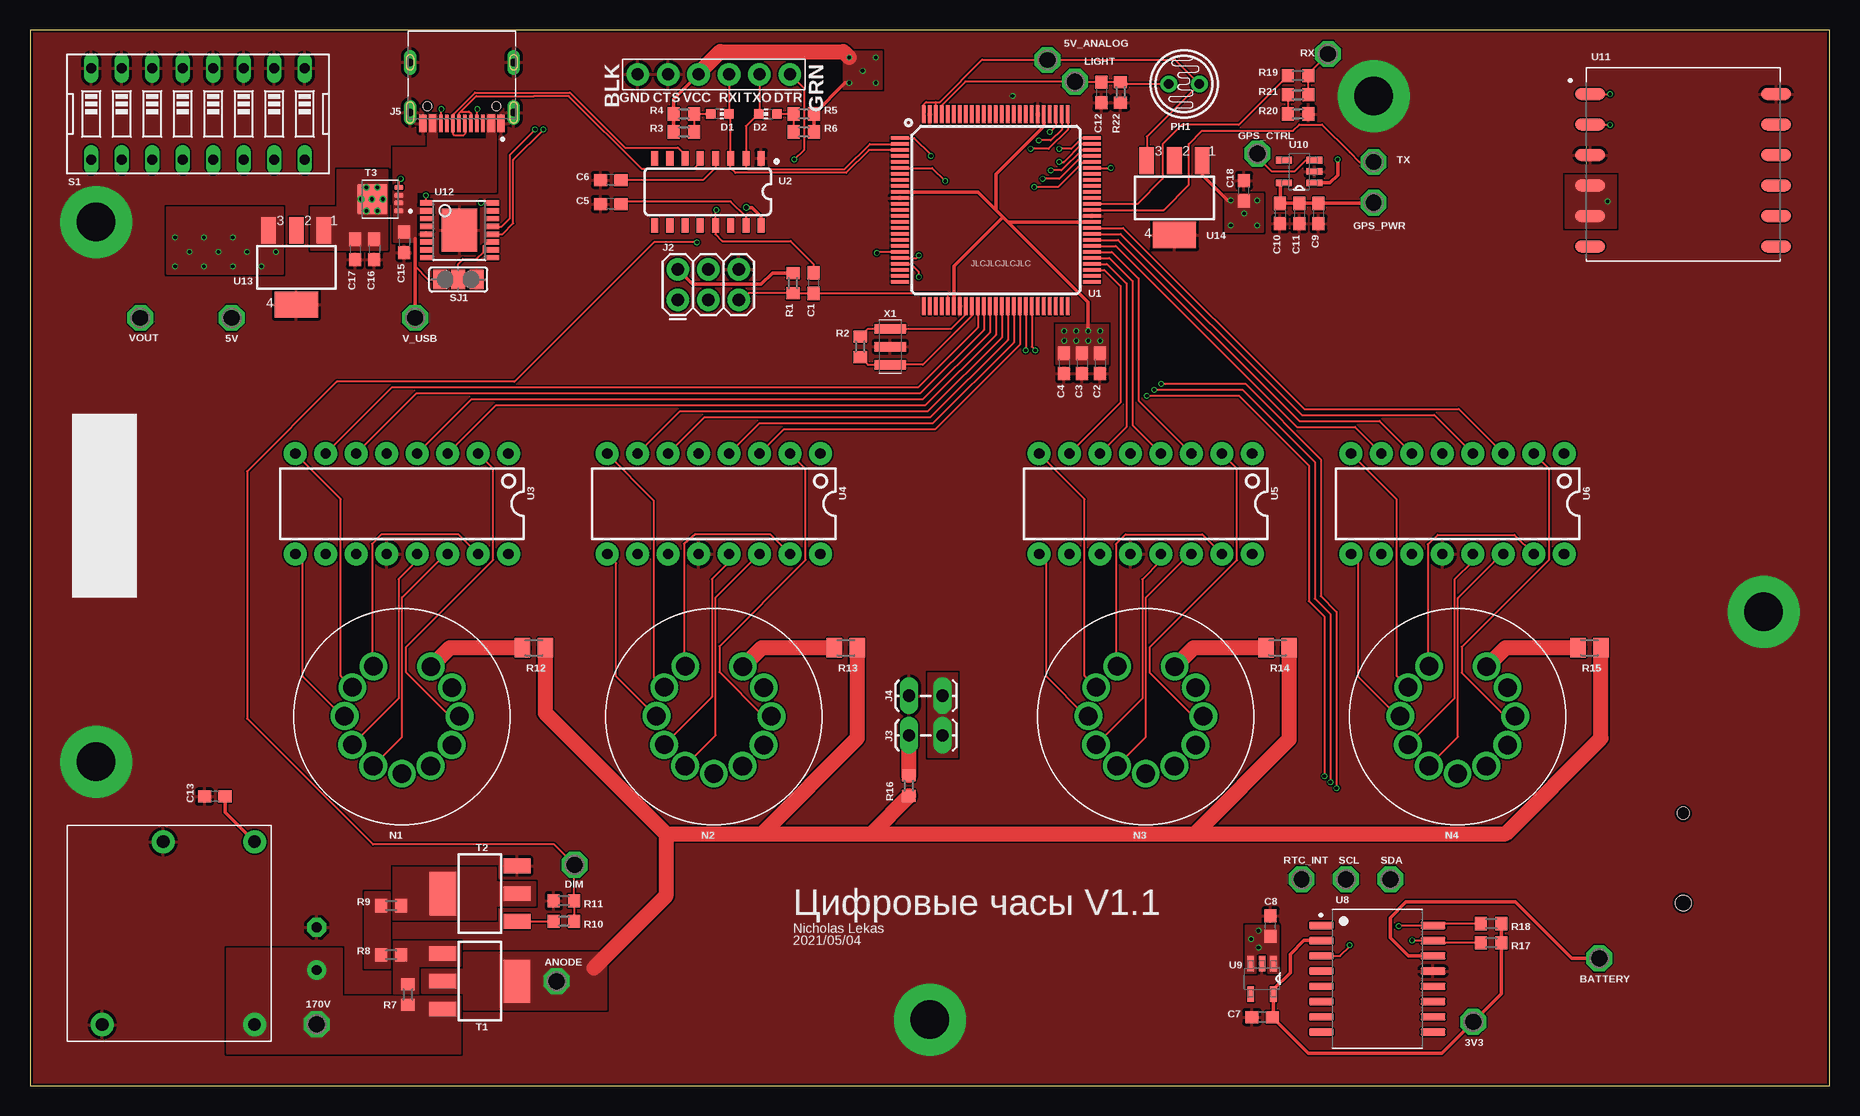
[diagram p5: board, top side]
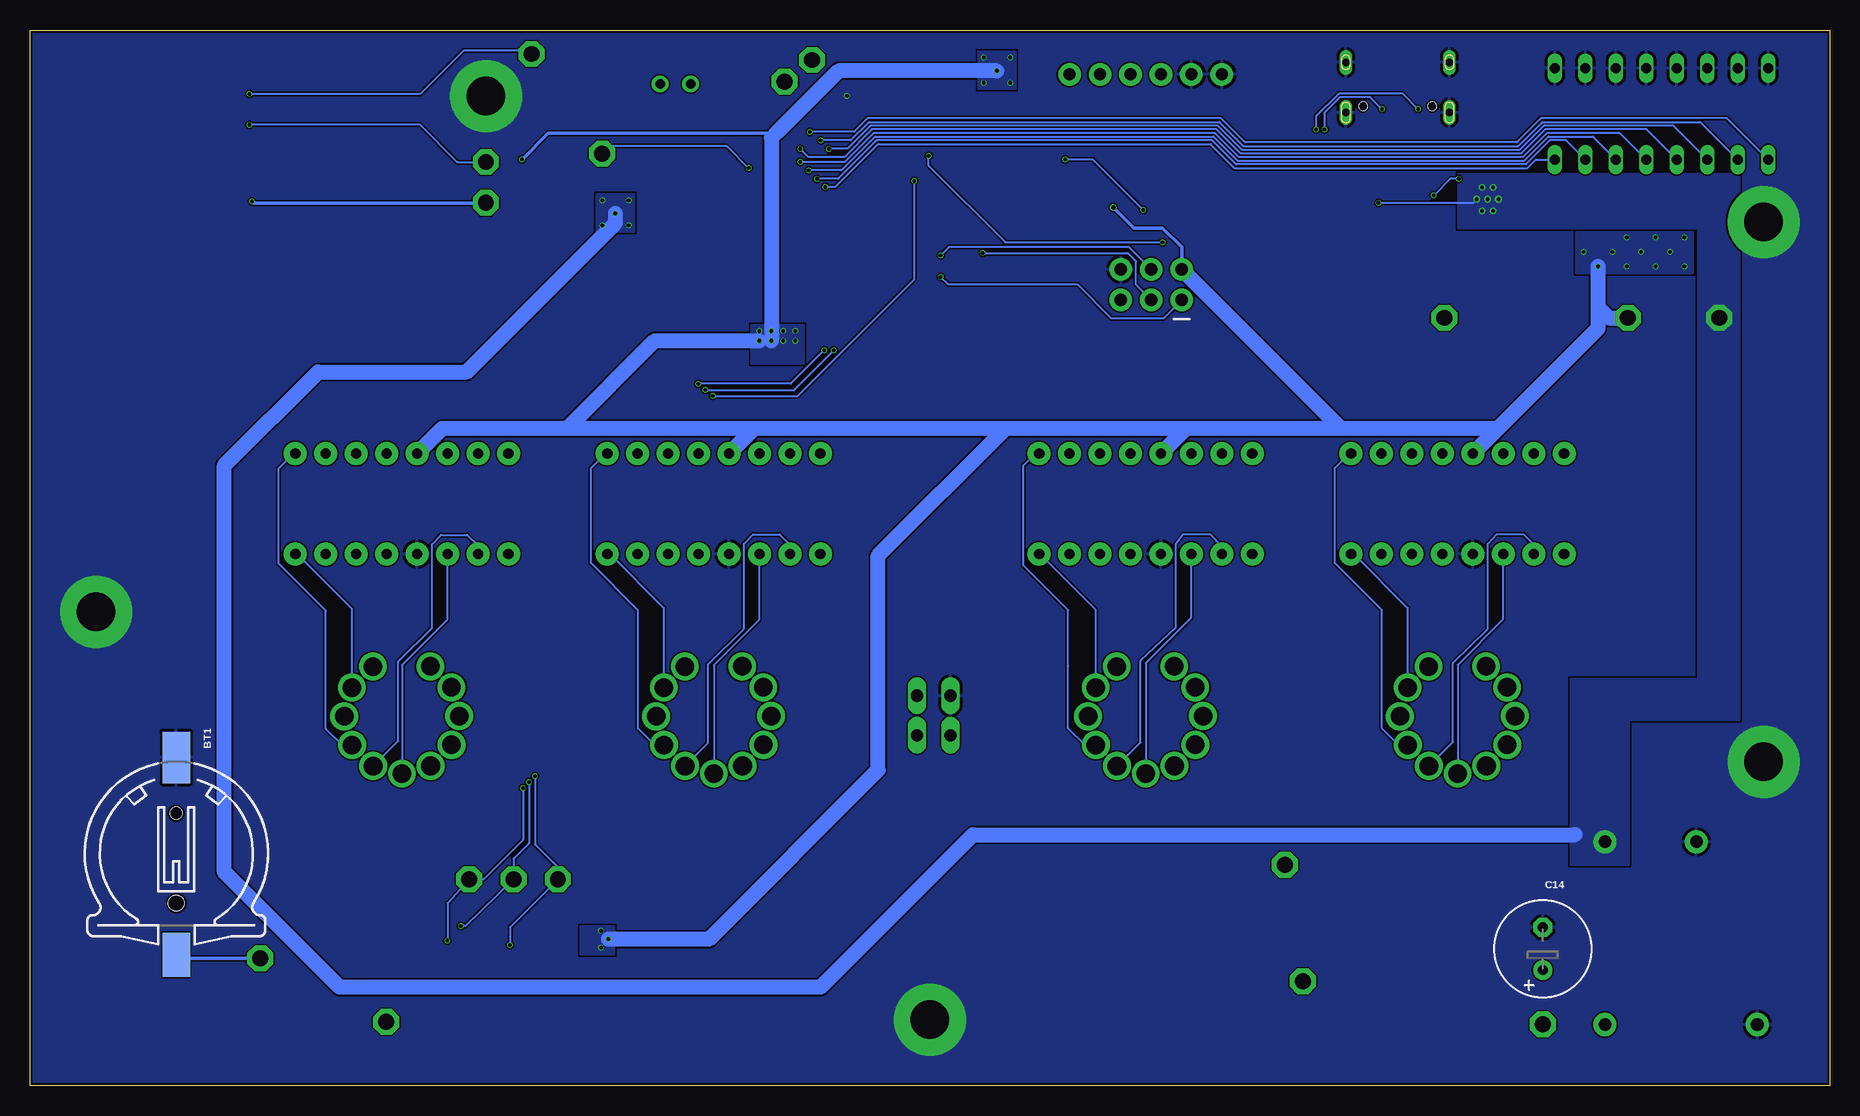
[diagram p6: board, bottom side, seen from below]

Size 150 x 88 mm. Coordinates in mm from the lower left corner, seen from the top.
Outline: 0,0 150,0 150,88 0,88 0,0
Copper layers (1*16): Top 0.035559375mm / dielectric 1.6mm / Bottom 0.035559375mm
Design rules "jlcpcb2layer": minimum track width 5mil, minimum drill 12mil, track to track 5mil, track to pad 5mil, pad to pad 5mil, via to via 5mil, smd to smd 5mil, copper to edge 8mil, drill to drill 6mil, minimum pad ring 5mil, minimum via ring 3mil, stop-mask expansion 2.5mil, vias tented up to drill 0mil, thermal gap 10mil

### Footprints (pad centres in the part's own frame; a part is rotated, then mirrored left to right if it is on the bottom)
P1-13 = drill 1.321 pad 2.159 octagon: TP 0,0
CH291-1220LF = smd 2.3 x 3.66: + 0,-2.296 | smd 2.3 x 4.3: - 0,14.146 | hole 1.3: 0,2 | hole 1: 0,9.5
C0603 = smd 1.1 x 1: 1 -0.85,0; 2 0.85,0
E3,5-8 = drill 0.813 pad 1.6: + -1.778,0 | drill 0.813 pad 1.6 octagon: - 1.778,0
CHIP-LED0603 = smd 0.8 x 0.8: A 0,-0.75; C 0,0.75
6_PIN_SERIAL_TARGET_SIDE_W_SILK = drill 1.016 pad 1.88: P$1 -6.35,0; P$2 -3.81,0; P$3 -1.27,0; P$4 1.27,0; P$5 3.81,0; P$6 6.35,0
2X3 = drill 1.016 pad 1.88: 1 0,0; 2 0,2.54; 3 2.54,0; 4 2.54,2.54; 5 5.08,0; 6 5.08,2.54
1X02_LOCK_LONGPADS = drill 1.016 long: 1 -0.127,0; 2 2.667,0
HRO_TYPE-C-31-M-12 = smd 0.6 x 1.45: A1B12 -3.25,5.095; A4B9 -2.45,5.095; B1A12 3.25,5.095; B4A9 2.45,5.095 | smd 0.3 x 1.45: A5 -1.25,5.095; A6 -0.25,5.095; A7 0.25,5.095; A8 1.25,5.095; B5 1.75,5.095; B6 0.75,5.095; B7 -0.75,5.095; B8 -1.75,5.095 | drill 0.65 pad 1.05 long: S1 -4.32,4.18; S2 4.32,4.18; S3 -4.32,0; S4 4.32,0 | hole 0.7: -2.89,3.65; 2.89,3.65
IN-8_SOCKET = drill 1.55: 0 4.167,7.173; 1 -2.371,8.944; 2 -4.129,7.196; 3 -4.777,4.803; 4 -4.142,2.406; 5 -2.393,0.648; 6 0,0; 7 2.397,0.635; 8 4.154,2.384; 9 4.803,4.777; A 2.419,8.931
TO46-VT200 = drill 0.8 pad 1.4: 1 -1.27,0; 2 1.27,0
R0603 = smd 1 x 1.1: 1 -0.85,0; 2 0.85,0
M0805 = smd 1.3 x 1.6: 1 -0.95,0; 2 0.95,0
EDG-08 = drill 0.813 long: 1 -8.89,-3.81; 2 -6.35,-3.81; 3 -3.81,-3.81; 4 -1.27,-3.81; 5 1.27,-3.81; 6 3.81,-3.81; 7 6.35,-3.81; 8 8.89,-3.81; 9 8.89,3.81; 10 6.35,3.81; 11 3.81,3.81; 12 1.27,3.81; 13 -1.27,3.81; 14 -3.81,3.81; 15 -6.35,3.81; 16 -8.89,3.81
SJ_2 = smd 1.168 x 1.6: 1 -1.524,0; 2 0,0; 3 1.524,0
SOT223 = smd 1.219 x 2.235: 1 -2.311,-3.099; 2 0,-3.099; 3 2.311,-3.099 | smd 3.6 x 2.2: 4 0,3.099
VSONP-8 = smd 0.7 x 0.4: 1 -1.55,0.975; 2 -1.55,0.325; 3 -1.55,-0.325; 4 -1.55,-0.975 | smd 2.51 x 2.55: 5 0.645,0 | drill 0.305 pad 0.5: 6 0.245,0.975; 7 1.15,0.975; 8 -0.207,0; 9 0.698,0; 10 1.603,0; 11 0.245,-0.975; 12 1.15,-0.975
TQFP100 = smd 1.5 x 0.3: 1 -8,6; 2 -8,5.5; 3 -8,5; 4 -8,4.5; 5 -8,4; 6 -8,3.5; 7 -8,3; 8 -8,2.5; 9 -8,2; 10 -8,1.5; 11 -8,1; 12 -8,0.5; 13 -8,0; 14 -8,-0.5; 15 -8,-1; 16 -8,-1.5; 17 -8,-2; 18 -8,-2.5; 19 -8,-3; 20 -8,-3.5; 21 -8,-4; 22 -8,-4.5; 23 -8,-5; 24 -8,-5.5; 25 -8,-6; 51 8,-6; 52 8,-5.5; 53 8,-5; 54 8,-4.5; 55 8,-4; 56 8,-3.5; 57 8,-3; 58 8,-2.5; 59 8,-2; 60 8,-1.5; 61 8,-1; 62 8,-0.5; 63 8,0; 64 8,0.5; 65 8,1; 66 8,1.5; 67 8,2; 68 8,2.5; 69 8,3; 70 8,3.5; 71 8,4; 72 8,4.5; 73 8,5; 74 8,5.5; 75 8,6 | smd 0.3 x 1.5: 26 -6,-8; 27 -5.5,-8; 28 -5,-8; 29 -4.5,-8; 30 -4,-8; 31 -3.5,-8; 32 -3,-8; 33 -2.5,-8; 34 -2,-8; 35 -1.5,-8; 36 -1,-8; 37 -0.5,-8; 38 0,-8; 39 0.5,-8; 40 1,-8; 41 1.5,-8; 42 2,-8; 43 2.5,-8; 44 3,-8; 45 3.5,-8; 46 4,-8; 47 4.5,-8; 48 5,-8; 49 5.5,-8; 50 6,-8; 76 6,8; 77 5.5,8; 78 5,8; 79 4.5,8; 80 4,8; 81 3.5,8; 82 3,8; 83 2.5,8; 84 2,8; 85 1.5,8; 86 1,8; 87 0.5,8; 88 0,8; 89 -0.5,8; 90 -1,8; 91 -1.5,8; 92 -2,8; 93 -2.5,8; 94 -3,8; 95 -3.5,8; 96 -4,8; 97 -4.5,8; 98 -5,8; 99 -5.5,8; 100 -6,8
SO016 = smd 0.6 x 1.2: 1 -4.445,-2.8; 2 -3.175,-2.8; 3 -1.905,-2.8; 4 -0.635,-2.8; 5 0.635,-2.8; 6 1.905,-2.8; 7 3.175,-2.8; 8 4.445,-2.8; 9 4.445,2.8; 10 3.175,2.8; 11 1.905,2.8; 12 0.635,2.8; 13 -0.635,2.8; 14 -1.905,2.8; 15 -3.175,2.8; 16 -4.445,2.8
DIL16-KIT = drill 0.864 pad 1.905: 1 -8.89,-4.191; 2 -6.35,-4.191; 3 -3.81,-4.191; 4 -1.27,-4.191; 5 1.27,-4.191; 6 3.81,-4.191; 7 6.35,-4.191; 8 8.89,-4.191; 9 8.89,4.191; 10 6.35,4.191; 11 3.81,4.191; 12 1.27,4.191; 13 -1.27,4.191; 14 -3.81,4.191; 15 -6.35,4.191; 16 -8.89,4.191
NCH8200HV = drill 1.05 pad 1.93: 1 -7.62,7.62; 2 7.62,7.62; 3 -7.62,0; 4 7.62,-5.08
SOIC127P1032X265-16N = smd 2.05 x 0.59: 1 -4.655,4.445; 2 -4.655,3.175; 3 -4.655,1.905; 4 -4.655,0.635; 5 -4.655,-0.635; 6 -4.655,-1.905; 7 -4.655,-3.175; 8 -4.655,-4.445; 9 4.655,-4.445; 10 4.655,-3.175; 11 4.655,-1.905; 12 4.655,-0.635; 13 4.655,0.635; 14 4.655,1.905; 15 4.655,3.175; 16 4.655,4.445
SOT95P280X130-5N = smd 1.321 x 0.559: 1 -1.27,0.94; 2 -1.27,0; 3 -1.27,-0.94; 4 1.27,-0.94; 5 1.27,0.94
XCVR_L80 = smd 2.5 x 1: 1 -7.75,6.35; 2 -7.75,3.81; 3 -7.75,1.27; 4 -7.75,-1.27; 5 -7.75,-3.81; 6 -7.75,-6.35; 7 7.75,-6.35; 8 7.75,-3.81; 9 7.75,-1.27; 10 7.75,1.27; 11 7.75,3.81; 12 7.75,6.35
TSSOP16EXP = smd 0.45 x 1.05: 1 -2.275,-2.768; 2 -1.625,-2.768; 3 -0.975,-2.768; 4 -0.325,-2.768; 5 0.325,-2.768; 6 0.975,-2.768; 7 1.625,-2.768; 8 2.275,-2.768; 9 2.275,2.768; 10 1.625,2.768; 11 0.975,2.768; 12 0.325,2.768; 13 -0.325,2.768; 14 -0.975,2.768; 15 -1.625,2.768; 16 -2.275,2.768 | smd 3.58 x 2.94: EXP 0,0
CSTCR6M = smd 0.8 x 2.6: 1 -1.5,0; 2 0,0; 3 1.5,0

### Placement (x,y rotation side)
3V3  120.3,5.3 0 top
5V  16.8,64 0 top
5V_ANALOG  84.8,85.5 0 top
170V  23.9,5.1 0 top
ANODE  43.9,8.7 0 top
BATTERY  130.8,10.6 0 top
BT1  137.8,13.2 0 bottom
C1  65.3,66.9 270 top
C2  89.2,60.2 270 top
C3  87.7,60.2 270 top
C4  86.2,60.2 270 top
C5  48.4,73.5 180 top
C6  48.4,75.5 180 top
C7  102.7,5.7 180 top
C8  103.4,13.3 90 top
C9  107.4,72.7 270 top
C10  104.2,72.7 270 top
C11  105.8,72.7 270 top
C12  89.3,82.8 270 top
C13  15.4,24.1 180 top
C14  23.9,11.4 90 bottom
C15  31.2,70.3 270 top
C16  28.7,69.7 270 top
C17  27.1,69.7 270 top
C18  101.2,74.6 90 top
D1  57.5,81 270 top
D2  61.5,81 90 top
DIM  45.4,18.4 0 top
GPS_CTRL  102.3,77.7 0 top
GPS_PWR  112,73.6 0 top
J1  57,84.3 180 top
J2  54,65.5 0 top
J3  73.4,29.2 0 top
J4  73.4,32.5 0 top
J5  36,85.3 180 top
LIGHT  87.1,83.7 0 top
N1  31,26 0 top
N2  57,26 0 top
N3  93,26 0 top
N4  119,26 0 top
PH1  96.2,83.5 180 top
R1  63.6,66.9 90 top
R2  69.2,61.6 270 top
R3  54.5,79.5 180 top
R4  54.5,81 180 top
R5  64.5,81 0 top
R6  64.5,79.5 180 top
R7  31.5,7.6 270 top
R8  30.1,10.9 180 top
R9  30.1,15 0 top
R10  44.5,13.7 0 top
R11  44.5,15.4 180 top
R12  42,36.5 180 top
R13  68,36.5 180 top
R14  104,36.5 180 top
R15  130,36.5 180 top
R16  73.25,25 90 top
R17  121.8,11.9 0 top
R18  121.8,13.5 0 top
R19  105.7,84.2 0 top
R20  105.7,81 180 top
R21  105.7,82.6 0 top
R22  90.9,82.8 90 top
RTC_INT  106,17.2 0 top
RX  108.2,86 0 top
S1  14,81 180 top
SCL  109.7,17.2 0 top
SDA  113.4,17.2 0 top
SJ1  35.7,67.2 0 top
T1  37.5,8.7 270 top
T2  37.5,16 90 top
T3  29.2,73.9 180 top
TX  112,77 0 top
U1  80.5,73 0 top
U2  56.5,74.5 180 top
U3  31,48.5 180 top
U4  57,48.5 180 top
U5  93,48.5 180 top
U6  119,48.5 180 top
U7  11.1,12.7 270 top
U8  112.3,8.9 0 top
U9  102.7,8.9 270 top
U10  105.8,76.2 180 top
U11  137.8,76.3 0 top
U12  35.8,71.3 270 top
U13  22.2,68.2 180 top
U14  95.4,74 180 top
V_USB  32.1,64 0 top
VOUT  9.2,64 0 top
X1  71.7,61.6 270 top

### Tracks (layer width: path | path; a pad name or v marks a point on that pad's centre or on a via)
+3V3
  Top 0.152: 105.05,9.41 105.05,9.5
  Top 0.254: 103.64,5.79 C7.1
  Top 0.305: 105.05,9.41 103.64,8.01 U9.5 103.64,5.79 | 105.05,9.5 105.05,10.95 106.2,12.1 107.62,12.1 U8.2 | C7.1 106.55,2.7 117.7,2.7 3V3.TP 122.65,7.65 R17.2 R18.2
+5V  (via drill 0.3, 0.35)
  Top 0.305: J2.2 55.24,66.8 60.95,66.8 61.9,67.75 R1.2 | U1.80 84.5,80 80.5,76 80.5,73 | U1.10 79,74.5 80.5,73 | U10.1 108.36,75.26 109,75.9 v109,77.2 | v88.2,62.9 88.2,65.3 81.5,72 | 81.1,72.4 80.5,73 | U1.61 81.5,72 | 81.5,72 81.1,72.4 | 81.1,72.4 77,68.3 U1.31 | R3.2 R4.2 53.65,82.22 J1.P$4 | U2.16 60.95,72.42 60.17,73.2 v59.7,73.2 | R6.1 R5.2 67.95,83.6 v68.3,83.6
  Top 1.27: J1.P$4 55.73,84.4 57.53,86.2 67.8,86.2 v68.3,85.7
  Bottom 0.305: 87.8,79.4 106.8,79.4 v109,77.2 | J2.2 54,69.9 55.6,71.5 58,71.5 v59.7,73.2
  Bottom 1.27: v19.3,68.3 19.3,64.9 | v101.8,12.2 93.4,12.2 79.3,26.3 79.3,44.19 68.7,54.78 | v69.4,84.6 82.6,84.6 87.8,79.4 88.2,79 v88.2,62.1 | 19.3,64.9 18.4,64 5V.TP | 19.3,64.9 19.3,63.12 27.64,54.78 | 27.64,54.78 U3.5 | 27.64,54.78 40.74,54.78 | 40.74,54.78 53.64,54.78 | 53.64,54.78 68.7,54.78 | 68.7,54.78 89.64,54.78 | 89.64,54.78 105.25,54.78 | 105.25,54.78 115.64,54.78 U6.5 | U4.5 53.64,54.78 | U5.5 89.64,54.78 | 105.25,54.78 97.94,62.1 v89.2,62.1 | J2.2 40.74,54.78
  other vias: 13.3,69.5 15.7,69.5 18.1,69.5 20.5,69.5 12.1,70.7 14.5,70.7 16.9,70.7 12.1,68.3 14.5,68.3 16.9,68.3 102.4,12.9 102.4,11.5 70.5,85.7 70.5,83.6 86.2,62.9 87.2,62.9 89.2,62.9 86.2,62.1 87.2,62.1
  pour Top (no thermals): 21.1,67.7 21.1,73.2 11.4,73.2 11.4,67.7
  pour Bottom (no thermals): 11.4,71.2 11.4,67.7 21.1,67.7 21.1,71.2
  pour Top (no thermals): 101.3,11.1 101.3,9.4 102.2,9.4 102.2,11 103.2,11 103.2,9.4 104.1,9.4 104.1,13.3 101.3,13.3
  pour Bottom (no thermals): 104.1,13.3 101.3,13.3 101.3,10.9 104.1,10.9
  pour Top (no thermals): 67.8,86.2 67.8,83.1 71,83.1 71,86.2
  pour Bottom (no thermals): 71,86.2 71,83.1 67.8,83.1 67.8,86.2
  pour Bottom (no thermals): 89.9,60.2 85.5,60.2 85.5,63.4 89.9,63.4
  pour Top (no thermals): 85.5,63.4 85.5,60.2 89.9,60.2 89.9,63.4
ANODE
  Top 1.27: R12.1 42.95,31.05 53,21 | R15.1 130.95,28.95 123,21 97.1,21 | 53,21 61,21 | 61,21 70.16,21 | 70.16,21 97.1,21 | R14.1 104.95,28.85 97.1,21 | R13.1 68.95,28.95 61,21 | R16.1 70.16,21 | 53,21 53,15.8 50.9,13.7 47,9.8
  pour Top (no thermals): 32.7,9.7 36.2,9.7 36.2,11.1 48,11.1 48,6.3 36.2,6.3 36.2,7.7 32.7,7.7
CC1  (via drill 0.3)
  Top 0.152: J5.A5 37.25,81.35 v37.3,81.4 | U12.13 39.33,71.62 40,72.3 40,77.6 v42.1,79.7
  Bottom 0.152: v37.3,81.4 38.3,82.4 40.8,82.4 42.1,81.1 v42.1,79.7
CC2  (via drill 0.3)
  Top 0.152: J5.B5 34.25,81.35 v34.3,81.4 | v42.8,79.7 40.28,77.18 40.28,71.88 39.38,70.97 U12.12
  Bottom 0.152: v34.3,81.4 35.58,82.68 40.92,82.68 42.8,80.8 v42.8,79.7
D+
  Top 0.152: J5.A7 35.75,81.05 35.9,81.2 | 35.9,81.2 36.6,81.2 36.75,81.05 J5.B7 | 35.9,81.2 37.2,82.5 42,82.5 44.9,82.5 51,76.4 55.3,76.4 55.87,76.97 U2.5
D-
  Top 0.152: J5.A6 36.25,79.35 36.1,79.2 35.4,79.2 35.25,79.35 J5.B6 35.3,80.25 35.3,80.99 37.08,82.78 45.02,82.78 49.59,78.2 54,78.2 54.59,77.61 U2.6
DIM  (via drill 0.3)
  Top 0.152: U1.1 73.7,79 75.1,77.6 v75.1,77.5 | v55.6,70.3 52,70.3 40.38,58.68 25.58,58.68 18.1,51.2 18.1,30.6 28.6,20.1 43.7,20.1 DIM.TP 45.35,18.4 R11.1 R10.2
  Bottom 0.152: v75.1,77.5 75.1,76.7 68.7,70.3 v55.6,70.3
DST  (via drill 0.3)
  Top 0.152: U1.71 88.48,76.98 87.75,76.98 85.68,74.9 v83.7,74.9
  Bottom 0.152: v83.7,74.9 82.9,74.9 79.31,78.5 51.6,78.5 49.6,76.5 25.17,76.5 24.48,77.19 S1.16
DTR  (via drill 0.3)
  Top 0.152: v57.2,73 57.13,72.94 U2.13 57.13,70.97 57.7,70.4 63.4,70.4 65.3,68.5 C1.1 | J1.P$1 64.5,83.15 64.5,78 v63.7,77.2
  Bottom 0.152: v57.2,73 61.4,77.2 v63.7,77.2
EIGHT  (via drill 0.3)
  Top 0.152: U1.74 88.48,78.48 87.66,78.48 86.18,77 v85.8,77
  Bottom 0.152: S1.13 17.49,79.41 23.55,79.41 25.55,77.41 49.23,77.41 51.22,79.41 79.68,79.41 82.09,77 v85.8,77
EXTRA1  (via drill 0.3)
  Top 0.152: U1.78 85.5,80 v85,79.5
  Bottom 0.152: S1.9 8.55,80.63 24.06,80.63 26.05,78.63 48.72,78.63 50.72,80.63 80.19,80.63 81.31,79.51 v84.99,79.51 v85,79.5
FOUR  (via drill 0.3)
  Top 0.152: U1.75 88.48,78.98 87.68,78.98 86.8,78.1 v85.8,78.1
  Bottom 0.152: S1.12 15.25,79.71 23.68,79.71 25.67,77.72 49.1,77.72 51.09,79.71 79.81,79.71 82.12,77.4 85.1,77.4 v85.8,78.1
GND  (via drill 0.3, 3.2 pad 6)
  other vias: 81.9,82.5 5.5,72 5.5,27 144.5,39.5 75,5.5 112,82.5
  pour Top (rank 2): -1,89 151,89 151,-1 -1,-1
  pour Bottom (rank 2): -2,90 152,90 152,-2 -2,-2
GPS_CTRL  (via drill 0.3)
  Top 0.152: U1.70 v90.1,76.5 | U10.3 107.04,77.11 106.31,77.11 105.41,76.2 103.5,76.2 102.3,77.4 GPS_CTRL.TP
  Bottom 0.152: v90.1,76.5 91.9,78.3 101.7,78.3 GPS_CTRL.TP
GPS_RX
  Top 0.152: U1.64 92.3,73.5 94.4,75.6 94.4,78.5 96,80.1 100.75,80.1 R19.1
GPS_TX  (via drill 0.3)
  Top 0.152: U1.63 94.5,73 96.6,75.1 96.6,78.5 97.7,79.6 105.29,79.6 105.8,80.11 107.7,80.11 110,77.81 110,77.8 110.8,77 TX.TP | U11.2 v131.69,80.11 v131.7,80.1
  Bottom 0.152: v131.7,80.1 v131.69,80.11 117.5,80.11 114.39,77 TX.TP
HOA
  Top 0.152: U1.42 82.5,61.75 75.45,54.7 62.82,54.7 U4.3
HOB
  Top 0.152: U1.40 81.5,62.16 75.04,55.7 56.2,55.7 U4.6
HOC
  Top 0.152: U1.39 81,62.37 74.83,56.2 54.16,56.2 U4.7
HOD
  Top 0.152: U1.41 82,61.96 75.24,55.2 60.78,55.2 U4.4
HTA
  Top 0.152: U1.38 80.5,62.58 74.62,56.7 38.82,56.7 U3.3
HTB
  Top 0.152: U1.36 79.5,62.99 74.21,57.7 32.2,57.7 U3.6
HTC
  Top 0.152: U1.35 79,63.2 74,58.2 30.16,58.2 U3.7
HTD
  Top 0.152: U1.37 80,62.79 74.41,57.2 36.78,57.2 U3.4
LIGHT
  Top 0.152: U1.97 76.02,81.02 76.02,81.75 77.98,83.7 LIGHT.TP 87.15,83.65 C12.1 R22.2 91.25,83.5 PH1.2
MISO  (via drill 0.3)
  Top 0.152: v74.1,67.4 74.08,67.42 74.08,67.84 73.42,68.5 U1.22
  Bottom 0.152: v74.1,67.4 73.5,66.8 62.7,66.8 59.9,64 55.5,64 J2.1
MOA
  Top 0.152: U1.60 91.12,71.5 106.22,56.4 119.1,56.4 U6.3
MOB
  Top 0.152: U1.58 90.71,70.5 105.81,55.4 112.48,55.4 U6.6
MOC
  Top 0.152: U1.57 90.5,70 105.6,54.9 110.44,54.9 U6.7
MOD
  Top 0.152: U1.59 90.91,71 106.01,55.9 117.06,55.9 U6.4
MOSI  (via drill 0.3)
  Top 0.152: U1.21 73.9,69 v74.1,69.2
  Bottom 0.152: J2.4 58.4,69.9 73.4,69.9 v74.1,69.2
MTA
  Top 0.152: U1.56 90.18,69.5 92.4,67.28 92.4,57.1 U5.3
MTB
  Top 0.152: U1.54 89.76,68.5 91.4,66.86 91.4,54.9 U5.6
MTC
  Top 0.152: U1.53 89.56,68 90.9,66.66 90.9,56.94 U5.7
MTD
  Top 0.152: U1.55 89.97,69 91.9,67.07 91.9,55.06 U5.4
N$1
  Top 0.152: U2.15 59.67,72.42 58.4,73.7 49.45,73.7 C5.1
N$2
  Top 0.152: U2.4 57.13,76.53 56.1,75.5 C6.1
N$3  (via drill 0.3)
  Top 0.152: T3.4 30.75,75.45 v30.9,75.6 | U12.1 33,73.61 v33,74.2
  Bottom 0.152: v30.9,75.6 31.6,75.6 v33,74.2
N$4
  Top 0.152: SJ1.2 35.7,68.5 36.1,68.9 37.2,68.9 37.8,69.5 37.8,70 38.12,70.33 U12.11
N$5
  Top 1.27: R16.2 73.25,29.18 J3.1
N$6
  Top 0.152: T2.1 R10.1
N$7
  pour Top (no thermals): 74.9,34.4 77.25,34.4 77.25,27.35 74.9,27.35
N$16
  Top 0.152: N1.9 35,30.78 31.32,34.46 31.32,36.52 38.62,43.82 38.62,51.42 U3.2
N$17
  Bottom 0.152: N1.8 35.92,28.38 37.32,29.78 37.32,39.63 41.25,43.56 41.25,51.49 40.05,52.69 U3.1
N$18
  Bottom 0.152: U3.10 24.65,45.09 25.52,45.96 27.72,45.96 28.5,45.16 28.5,38.08 31.38,35.22 31.38,28.65 N1.7
N$19
  Bottom 0.152: N1.6 31,35.07 27.19,38.88 U3.11
N$20
  Top 0.152: U3.14 34.63,44.31 31.01,40.69 31.01,29.05 N1.5
N$21
  Top 0.152: N1.4 30.71,32.26 30.71,42.21 32.27,43.77 U3.13
N$22
  Top 0.152: N1.3 26.01,30.8 22.71,34.1 22.71,43.7 U3.9
N$23
  Top 0.152: N1.2 25.91,34.16 25.91,48.89 U3.8
N$24
  Top 0.152: U3.15 35.7,45.96 29.32,45.96 28.5,45.15 28.5,35.07 N1.1
N$25
  Bottom 0.152: U3.16 39.65,44.31 35.17,39.83 N1.0
N$26
  Top 1.27: R12.2 34.99,36.5 N1.A
N$27
  Top 0.152: N2.9 61.15,30.78 57.46,34.46 57.46,36.62 64.66,43.82 64.66,51.38 U4.2
N$28
  Bottom 0.152: N2.8 62.07,28.38 63.46,29.78 63.46,35 63.46,39.63 67.19,43.36 67.19,51.69 66.19,52.69 U4.1
N$29
  Bottom 0.152: U4.10 50.65,44.95 51.66,45.96 53.86,45.96 54.5,45.16 54.5,38.18 57.43,35.42 57.43,28.6 N2.7
N$30
  Bottom 0.152: N2.6 57,35.21 53.19,39.02 U4.11
N$31
  Top 0.152: U4.14 60.78,44.31 57.16,40.69 57.16,29.2 N2.5
N$32
  Top 0.152: N2.4 56.85,32.4 56.85,42.21 58.27,43.63 U4.13
N$33
  Top 0.152: N2.3 52.15,30.8 48.86,34.1 48.86,43.56 U4.9
N$34
  Top 0.152: N2.2 52,34.01 52,48.75 U4.8
N$35
  Top 0.152: U4.15 61.7,45.96 55.46,45.96 54.5,45.15 54.5,34.97 N2.1
N$36
  Bottom 0.152: U4.16 65.8,44.31 61.17,39.68 N2.0
N$37
  Top 1.27: R13.2 60.99,36.5 N2.A
N$49
  Top 0.152: D1.A R4.1 R3.1
N$50
  Top 0.152: R6.2 R5.1 D2.A
N$51
  pour Top (no thermals): 35.9,7.4 26,7.4 26,11.4 16.4,11.4 16.4,2.7 35.9,2.7
N$53
  pour Top (no thermals): 35.9,10 35.9,12 30.3,12 30.3,7.7 32.4,7.7 32.4,10
N$55
  Top 0.305: U8.14 114.89,10.8 113.4,12.3 113.4,14 114.7,15.3 123.8,15.3 128.5,10.6 BATTERY.TP
  Bottom 0.305: BT1.+ 137.5,10.6 BATTERY.TP
N$56  (via drill 0.3)
  Top 0.152: 104.23,73.58 C10.1
  Top 0.305: U10.5 104.23,74.96 104.23,73.58 | C10.1 C11.1 C9.1 111.85,73.55 GPS_PWR.TP
  Bottom 0.305: v131.5,73.7 131.35,73.55 111.95,73.55 GPS_PWR.TP
  pour Top (no thermals): 128,75.9 132.2,75.9 132.2,71.5 128,71.5
N$57  (via drill 0.3)
  Top 0.152: R21.2 R19.2 106.55,84.35 RX.TP | U11.1 v131.7,82.65
  Bottom 0.152: v131.7,82.65 117.48,82.65 113.83,86.3 108.5,86.3 RX.TP
N$58
  Top 0.152: R21.1 R20.2
N$60
  Top 0.152: R2.2 69.85,60.1 X1.3 72.6,60.1 74.43,60.1 78.5,64.17 U1.34
N$61
  Top 0.152: R2.1 69.85,63.1 X1.1 76.8,63.1 78,64.3 U1.33
N$62
  Top 0.152: N3.9 96.99,30.78 93.32,34.45 93.32,36.51 100.62,43.81 100.62,51.42 U5.2
N$63
  pour Top (no thermals): 38.8,17 42.1,17 42.1,15 38.8,15 38.8,13.8 30.3,13.8 30.3,18.2 38.8,18.2
N$64
  pour Top (no thermals): 27.9,9.8 30,9.8 30,16.1 27.9,16.1
N$65
  Bottom 0.152: N3.8 97.94,28.38 99.32,29.77 99.32,39.62 103.25,43.55 103.25,51.48 102.04,52.69 U5.1
N$66
  Bottom 0.152: N3.7 93.48,28.55 93.48,35.11 90.5,38.07 90.5,45.15 89.72,45.95 87.52,45.95 86.65,45.08 U5.10
N$67
  Bottom 0.152: N3.6 93,35.06 89.19,38.87 U5.11
N$68
  Top 0.152: U5.14 96.65,44.31 93.01,40.68 93.01,29.05 N3.5
N$69
  Top 0.152: N3.4 92.71,32.26 92.71,42.2 94.27,43.76 U5.13
N$70
  Top 0.152: N3.3 88,30.8 84.71,34.08 84.71,43.7 U5.9
N$71
  Top 0.152: N3.2 87.91,34.16 87.91,48.89 U5.8
N$72
  Top 0.152: U5.15 97.71,45.95 91.32,45.95 90.5,45.14 90.5,35.07 N3.1
N$73
  Bottom 0.152: U5.16 101.66,44.31 97.17,39.81 N3.0
N$74
  Top 1.27: R14.2 96.99,36.5 N3.A
N$86
  Top 0.152: N4.9 122.98,30.78 119.34,34.42 119.34,36.58 126.64,43.88 126.64,51.4 U6.2
N$87
  Bottom 0.152: N4.8 123.99,28.38 125.34,29.73 125.34,39.59 129.28,43.52 129.28,51.44 128.03,52.69 U6.1
N$88
  Bottom 0.152: U6.10 112.65,45.02 113.54,45.92 115.74,45.92 116.5,45.12 116.5,38.13 119.31,35.37 119.31,28.72 N4.7
N$89
  Bottom 0.152: N4.6 119,35.05 115.19,38.86 U6.11
N$90
  Top 0.152: U6.14 122.7,44.31 119.04,40.64 119.04,29.08 N4.5
N$91
  Top 0.152: N4.4 118.73,32.28 118.73,42.17 120.27,43.7 U6.13
N$92
  Top 0.152: N4.3 113.99,30.8 110.74,34.05 110.74,43.68 U6.9
N$93
  Top 0.152: N4.2 113.94,34.13 113.94,48.87 U6.8
N$94
  Top 0.152: U6.15 123.74,45.92 117.34,45.92 116.5,45.1 116.5,35.04 N4.1
N$95
  Bottom 0.152: U6.16 127.72,44.31 123.17,39.76 N4.0
N$96
  Top 1.27: R15.2 122.99,36.5 N4.A
ONE  (via drill 0.3)
  Top 0.152: U1.77 86,79.7 85.1,78.8 v84.1,78.8
  Bottom 0.152: S1.10 10.78,80.32 23.93,80.32 25.93,78.33 48.85,78.33 50.84,80.32 80.06,80.32 81.59,78.79 v84.09,78.79 v84.1,78.8
PLUS_MINUS  (via drill 0.3)
  Top 0.152: U1.73 87.68,78 85.98,76.3 v85.1,76.3
  Bottom 0.152: S1.14 19.73,79.11 23.43,79.11 25.42,77.11 49.35,77.11 51.35,79.11 79.56,79.11 82.36,76.3 v85.1,76.3
RST
  Top 0.152: U1.30 76.5,65.9 76.35,66.05 C1.2 R1.1 59.9,66.05 59.63,66.05 J2.5
RTC_INT  (via drill 0.3)
  Top 0.152: U1.6 75.2,76.5 v76.3,75.4 | U8.3 109.2,10.8 110,11.6 v110,11.7 | v93.1,57.49 100.81,57.49 106.6,51.7 106.6,40.39 107.9,39.09 v107.9,25.8
  Bottom 0.152: v76.3,75.4 76.3,67.2 86,57.49 v93.1,57.49 | v107.9,25.8 107.9,20.1 106,18.2 RTC_INT.TP 110,13.2 110,12.4 v110,11.7
RXI
  Top 0.152: J1.P$3 58.27,81.02 D1.C 58.41,80.84 U2.3 58.4,76.5 58.8,76.09 68.03,76.09 69.93,78 U1.3
SCK  (via drill 0.3)
  Top 0.152: U1.20 72.48,69.48 70.66,69.48 70.6,69.42 v70.6,69.4
  Bottom 0.152: J2.3 57.81,66.77 57.81,68.72 58.5,69.41 70.43,69.41 70.44,69.4 v70.6,69.4
SCL  (via drill 0.3)
  Top 0.152: R18.1 117.11,13.5 U8.16 116.91,13.3 v114.1,13.3 | U1.43 v83,61.3 | v93.7,58 101.1,58 107.1,52 107.1,40.59 108.4,39.29 v108.4,25.3
  Bottom 0.152: v83,61.3 86.3,58 v93.7,58 | v108.4,25.3 108.4,20.2 109.7,18.9 SCL.TP 113.7,13.3 v114.1,13.3
SDA  (via drill 0.3)
  Top 0.152: R17.1 117.13,11.9 U8.15 115.22,12.07 v115.2,12.1 | U1.44 83.5,61.6 v83.8,61.3 | v94.3,58.51 101.3,58.51 107.6,52.2 107.6,40.8 108.9,39.5 v108.9,24.8
  Bottom 0.152: v83.8,61.3 86.59,58.51 v94.3,58.51 | v108.9,24.8 108.9,20.5 112.2,17.2 SDA.TP 115.2,15.2 v115.2,12.1
TIME_MODE  (via drill 0.3)
  Top 0.152: U1.72 87.71,77.5 85.8,75.59 v84.41,75.59 v84.4,75.6
  Bottom 0.152: S1.15 21.96,78.8 23.3,78.8 25.3,76.81 49.48,76.81 51.47,78.8 79.43,78.8 82.63,75.6 v84.4,75.6
TWO  (via drill 0.3)
  Top 0.152: U1.76 86.5,79.7 84.9,78.1 v83.4,78.1
  Bottom 0.152: S1.11 13.02,80.02 23.8,80.02 25.8,78.02 48.97,78.02 50.97,80.02 79.94,80.02 81.83,78.13 83.37,78.13 v83.4,78.1
TXO
  Top 0.152: J1.P$2 60.81,81.06 D2.C 60.67,81 59.67,80 U2.2 59.67,76.53 59.8,76.4 67.9,76.4 70,78.5 U1.2
V_USB
  Top 0.152: 32.1,68.3 32.1,70.6 | 32.1,68.3 33.2,67.2 SJ1.1 | 32.1,68.3 V_USB.TP
  Top 0.305: 32.1,70.6 V_USB.TP
  pour Top (no thermals): 32.2,74.5 30.3,74.5 30.3,70.3 32.2,70.3 32.2,72.7 33.6,72.7 33.6,73.2 32.2,73.2
  pour Top (no thermals): 33.2,78.2 33.2,81 33.9,81 33.9,78.9 38.1,78.9 38.1,81 38.8,81 38.8,74.5 32.2,74.5 32.2,73.6 30.3,73.6 30.3,78.2
VCCA
  Top 0.152: U1.100 74.5,81.8 74.7,82 75.5,82 | U1.98 75.5,82 | 84.77,85.53 79.37,85.53 75.85,82 75.5,82 | 84.77,85.53 95.44,85.53 PH1.1 93.09,79.12 U14.3 | 84.77,85.53 5V_ANALOG.TP
VOUT  (via drill 0.3)
  Top 0.152: U12.16 37.62,73.58 v37.6,73.6
  Top 0.305: U14.1 97.71,75.9 99.81,73.8 v100.1,73.8 | U7.1 16.25,22.79 C13.1
  Bottom 0.152: v37.6,73.6 29.71,73.6 T3.8
  Bottom 1.27: v101.2,72.7 101.2,71.9 113.6,59.5 126,59.5 133.8,51.7 133.8,17.8 124.2,8.2 84.1,8.2 71.4,20.9 21.2,20.9
  other vias: 102.3,73.8 102.3,71.7 100.1,71.7
  pour Top (no thermals): 23.4,73.2 23.4,69.7 29.8,69.7 29.8,76.3 25.6,76.3 25.6,73.2
  pour Bottom (no thermals): 7.5,76 31,76 31,71.5 11,71.5 11,30.5 7.5,30.5
  pour Top (no thermals): 99.6,74.3 99.6,71.2 102.8,71.2 102.8,74.3
  pour Bottom (no thermals): 102.8,74.3 102.8,71.2 99.6,71.2 99.6,74.3
  pour Bottom (no thermals): 7.5,33.9 21.6,33.9 21.6,18.4 16.7,18.4 16.7,30.5 7.5,30.5

### Text on the board
tPlace: Цифровые часы V1.1 | Nicholas Lekas | 2021/05/04
tNames: JLCJLCJLCJLC